# EAGLE design ECEN 4350 Lab 3 (EAGLE 9.6.2)

## Sheet 1 of 8
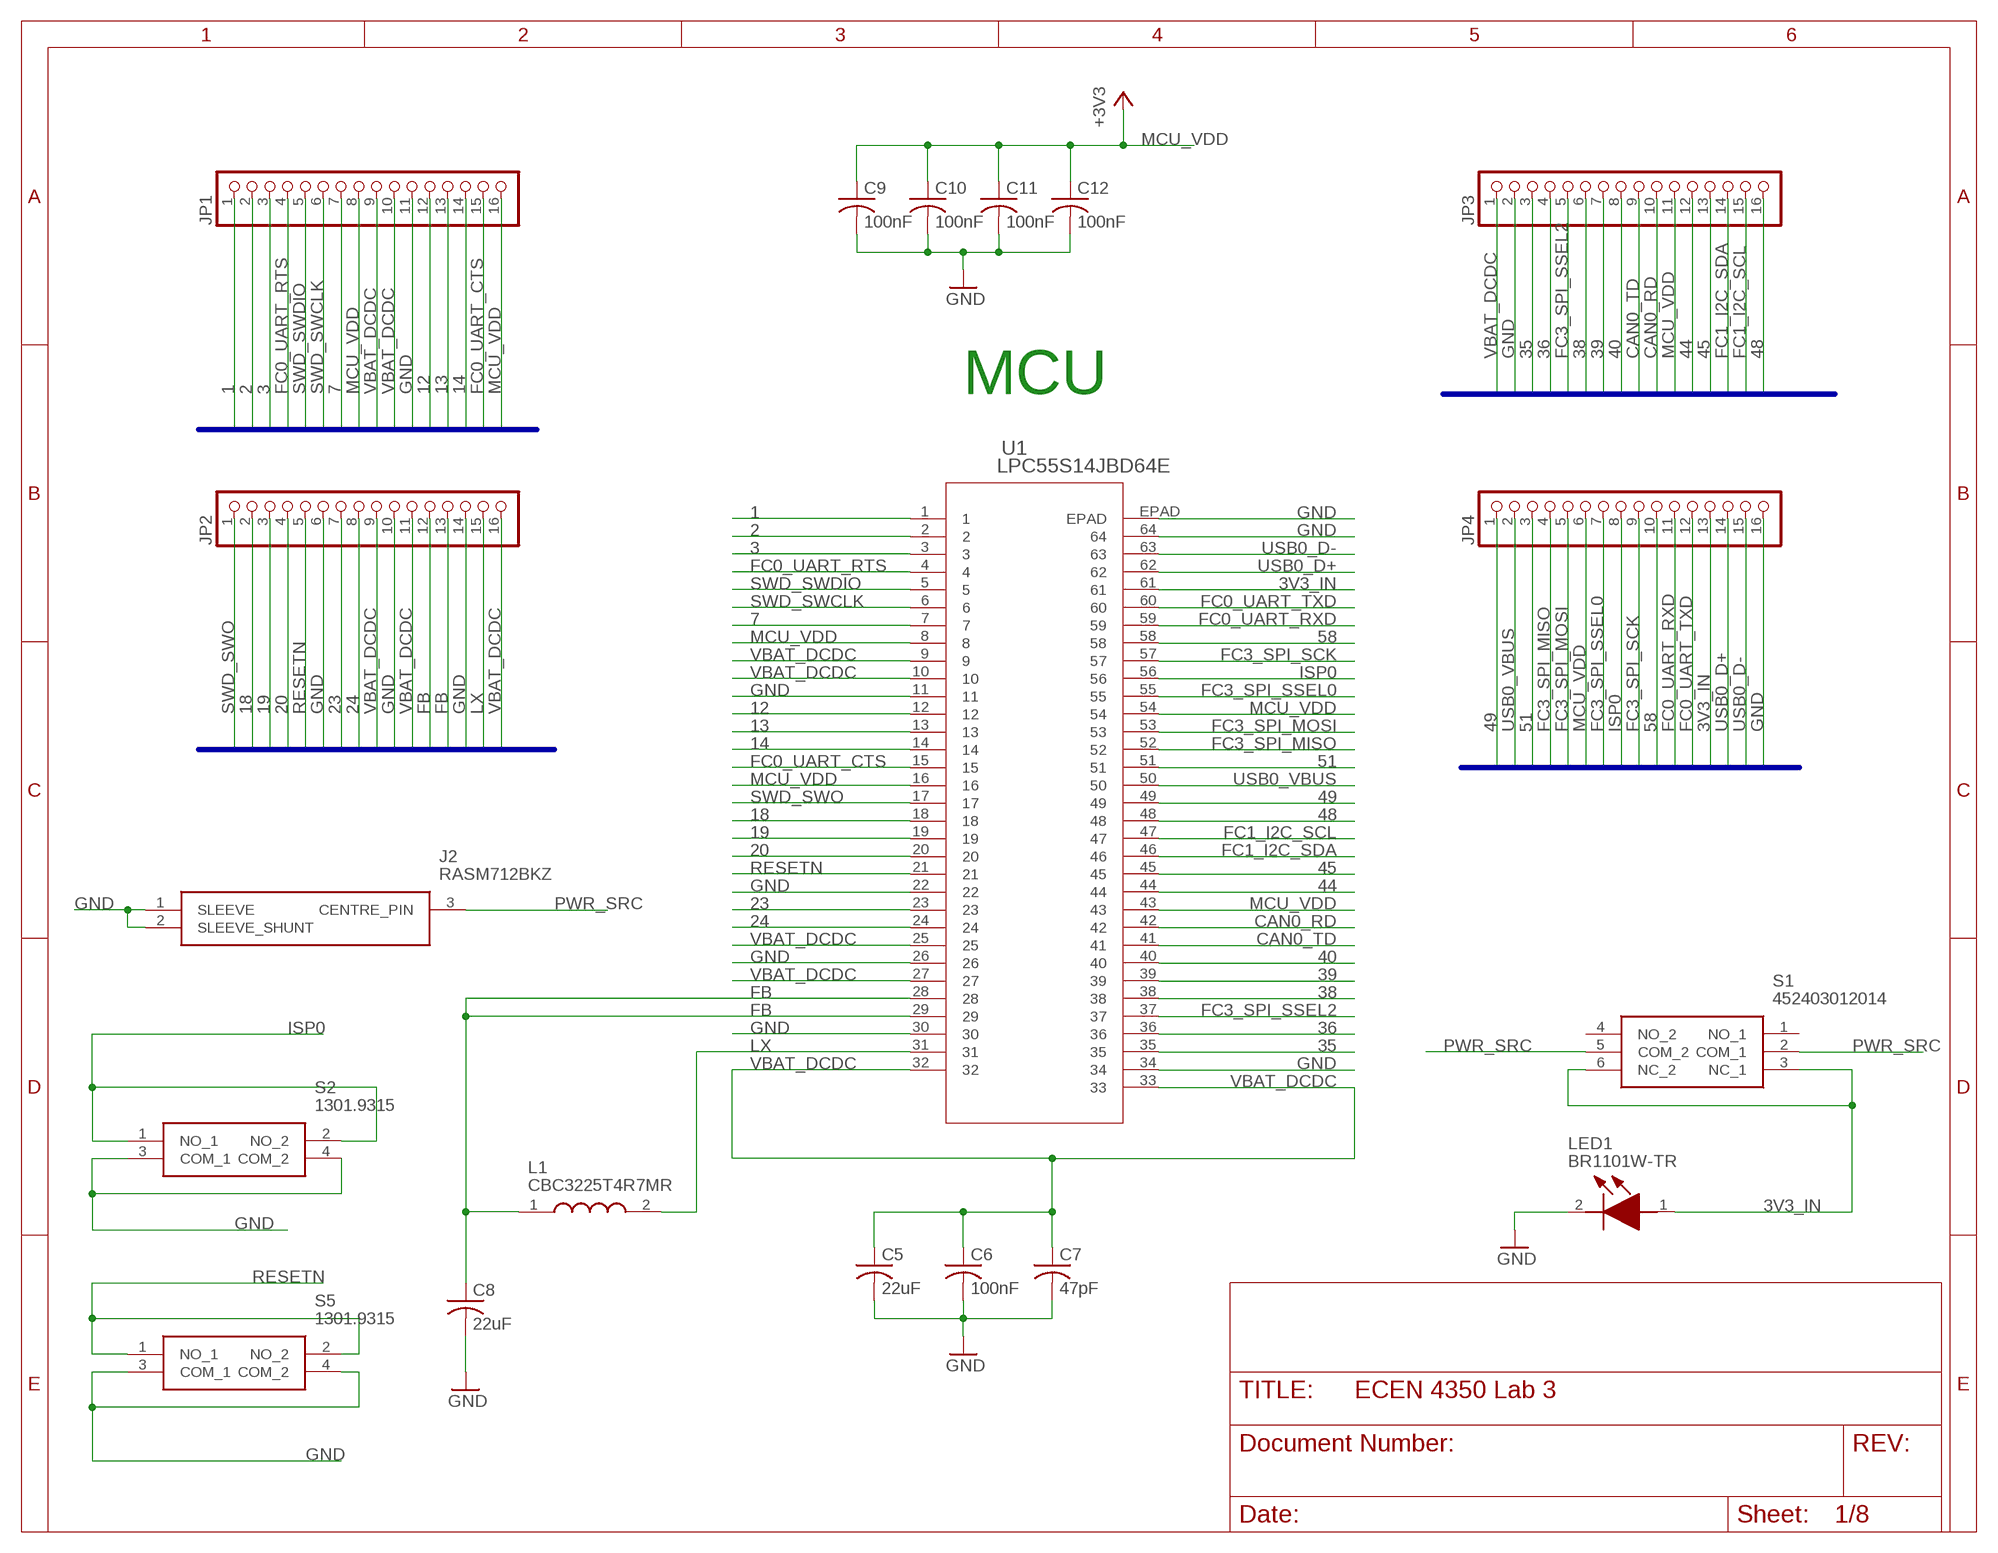
[diagram p0: schematic, sheet 1]

### Parts
C5  22uF  C-USC1206  [C1206]
C6  100nF  C-USC1206  [C1206]
C7  47pF  C-USC1206  [C1206]
C8  22uF  C-USC1206  [C1206]
C9  100nF  C-USC1206  [C1206]
C10  100nF  C-USC1206  [C1206]
C11  100nF  C-USC1206  [C1206]
C12  100nF  C-USC1206  [C1206]
J2  RASM712BKZ  [RASM712BKZ]
JP1  PINHD-1X16  [1X16]
JP2  PINHD-1X16  [1X16]
JP3  PINHD-1X16  [1X16]
JP4  PINHD-1X16  [1X16]
L1  CBC3225T4R7MR  [INDC3225X270N]
LED1  BR1101W-TR  [BR1101WTR]
S1  452403012014  [452403012014]
S2  1301.9315  [13019319]
S5  1301.9315  [13019319]
U1  LPC55S14JBD64E  [HTQFP64_10X10_NXP]

### Nets
1: JP1.1 U1.1
2: JP1.2 U1.2
3: JP1.3 U1.3
3V3_IN: JP4.13 LED1.1(A) S1.3(NC_1) S1.6(NC_2) U1.61 ; also sheet 3,4,5,6,7,8
7: JP1.7 U1.7
12: JP1.12 U1.12
13: JP1.13 U1.13
14: JP1.14 U1.14
18: JP2.2 U1.18
19: JP2.3 U1.19
20: JP2.4 U1.20
23: JP2.7 U1.23
24: JP2.8 U1.24
35: JP3.3 U1.35
36: JP3.4 U1.36
38: JP3.6 U1.38
39: JP3.7 U1.39
40: JP3.8 U1.40
44: JP3.12 U1.44
45: JP3.13 U1.45
48: JP3.16 U1.48
49: JP4.1 U1.49
51: JP4.3 U1.51
58: JP4.10 U1.58
CAN0_RD: JP3.10 U1.42 ; also sheet 3
CAN0_TD: JP3.9 U1.41 ; also sheet 3
FB: C8.1 JP2.12 JP2.13 L1.1 U1.28 U1.29
FC0_UART_CTS: JP1.15 U1.15
FC0_UART_RTS: JP1.4 U1.4
FC0_UART_RXD: JP4.11 U1.59 ; also sheet 5
FC0_UART_TXD: JP4.12 U1.60 ; also sheet 5
FC1_I2C_SCL: JP3.15 U1.47 ; also sheet 7,8
FC1_I2C_SDA: JP3.14 U1.46 ; also sheet 7,8
FC3_SPI_MISO: JP4.4 U1.52 ; also sheet 4,7
FC3_SPI_MOSI: JP4.5 U1.53 ; also sheet 4,7
FC3_SPI_SCK: JP4.9 U1.57 ; also sheet 4,7
FC3_SPI_SSEL0: JP4.7 U1.55 ; also sheet 4
FC3_SPI_SSEL2: JP3.5 U1.37 ; also sheet 7
GND: C5.2 C6.2 C7.2 C8.2 C9.2 C10.2 C11.2 C12.2 J2.1(SLEEVE) J2.2(SLEEVE_SHUNT) JP1.11 JP2.6 JP2.10 JP2.14 JP3.2 JP4.16 LED1.2(K) S2.3(COM_1) S2.4(COM_2) S5.3(COM_1) S5.4(COM_2) U1.11 U1.22 U1.26 U1.30 U1.34 U1.64 U1.EPAD ; also sheet 2,3,4,5,6,7,8
ISP0: JP4.8 S2.1(NO_1) S2.2(NO_2) U1.56
LX: JP2.15 L1.2 U1.31
MCU_VDD: C9.1 C10.1 C11.1 C12.1 JP1.8 JP1.16 JP3.11 JP4.6 U1.8 U1.16 U1.43 U1.54 ; supply symbol labelled +3V3
PWR_SRC: J2.3(CENTRE_PIN) S1.2(COM_1) S1.5(COM_2)
RESETN: JP2.5 S5.1(NO_1) S5.2(NO_2) U1.21 ; also sheet 6
SWD_SWCLK: JP1.6 U1.6 ; also sheet 6
SWD_SWDIO: JP1.5 U1.5 ; also sheet 6
SWD_SWO: JP2.1 U1.17 ; also sheet 6
USB0_D+: JP4.14 U1.62 ; also sheet 2
USB0_D-: JP4.15 U1.63 ; also sheet 2
USB0_VBUS: JP4.2 U1.50 ; also sheet 2
VBAT_DCDC: C5.1 C6.1 C7.1 JP1.9 JP1.10 JP2.9 JP2.11 JP2.16 JP3.1 U1.9 U1.10 U1.25 U1.27 U1.32 U1.33
Unconnected: S1.1(NO_1) S1.4(NO_2)

### Buses
MCU1:1,2,3,7,8,9,10,11,12,13,14,16,FC0_UART_CTS,FC0_UART_RTS,SWD_SWCLK,SWD_SWDIO
MCU2:18,19,20,FB,LX,RESETN,SWD_SWO,USB1_DP,USB1_VSS,VBAT_DCDC,VSS_DCDC
34,35,36,38,39,40,43,44,45,48,CAN0_RD,CAN0_TD,FC1_I2C_SCL,FC1_I2C_SDA,FC3_SPI_SSEL2,GND,VBAT_PMU
49,51,58,FC0_UART_RXD,FC0_UART_TXD,FC3_SPI_MISO,FC3_SPI_MOSI,FC3_SPI_SCK,FC3_SPI_SSEL0,ISP0,USB0_3V3,USB0_D-,USB0_D+,USB0_VBUS,USB0_VSS,VDD

### Notes on the sheet
- MCU

## Sheet 2 of 8
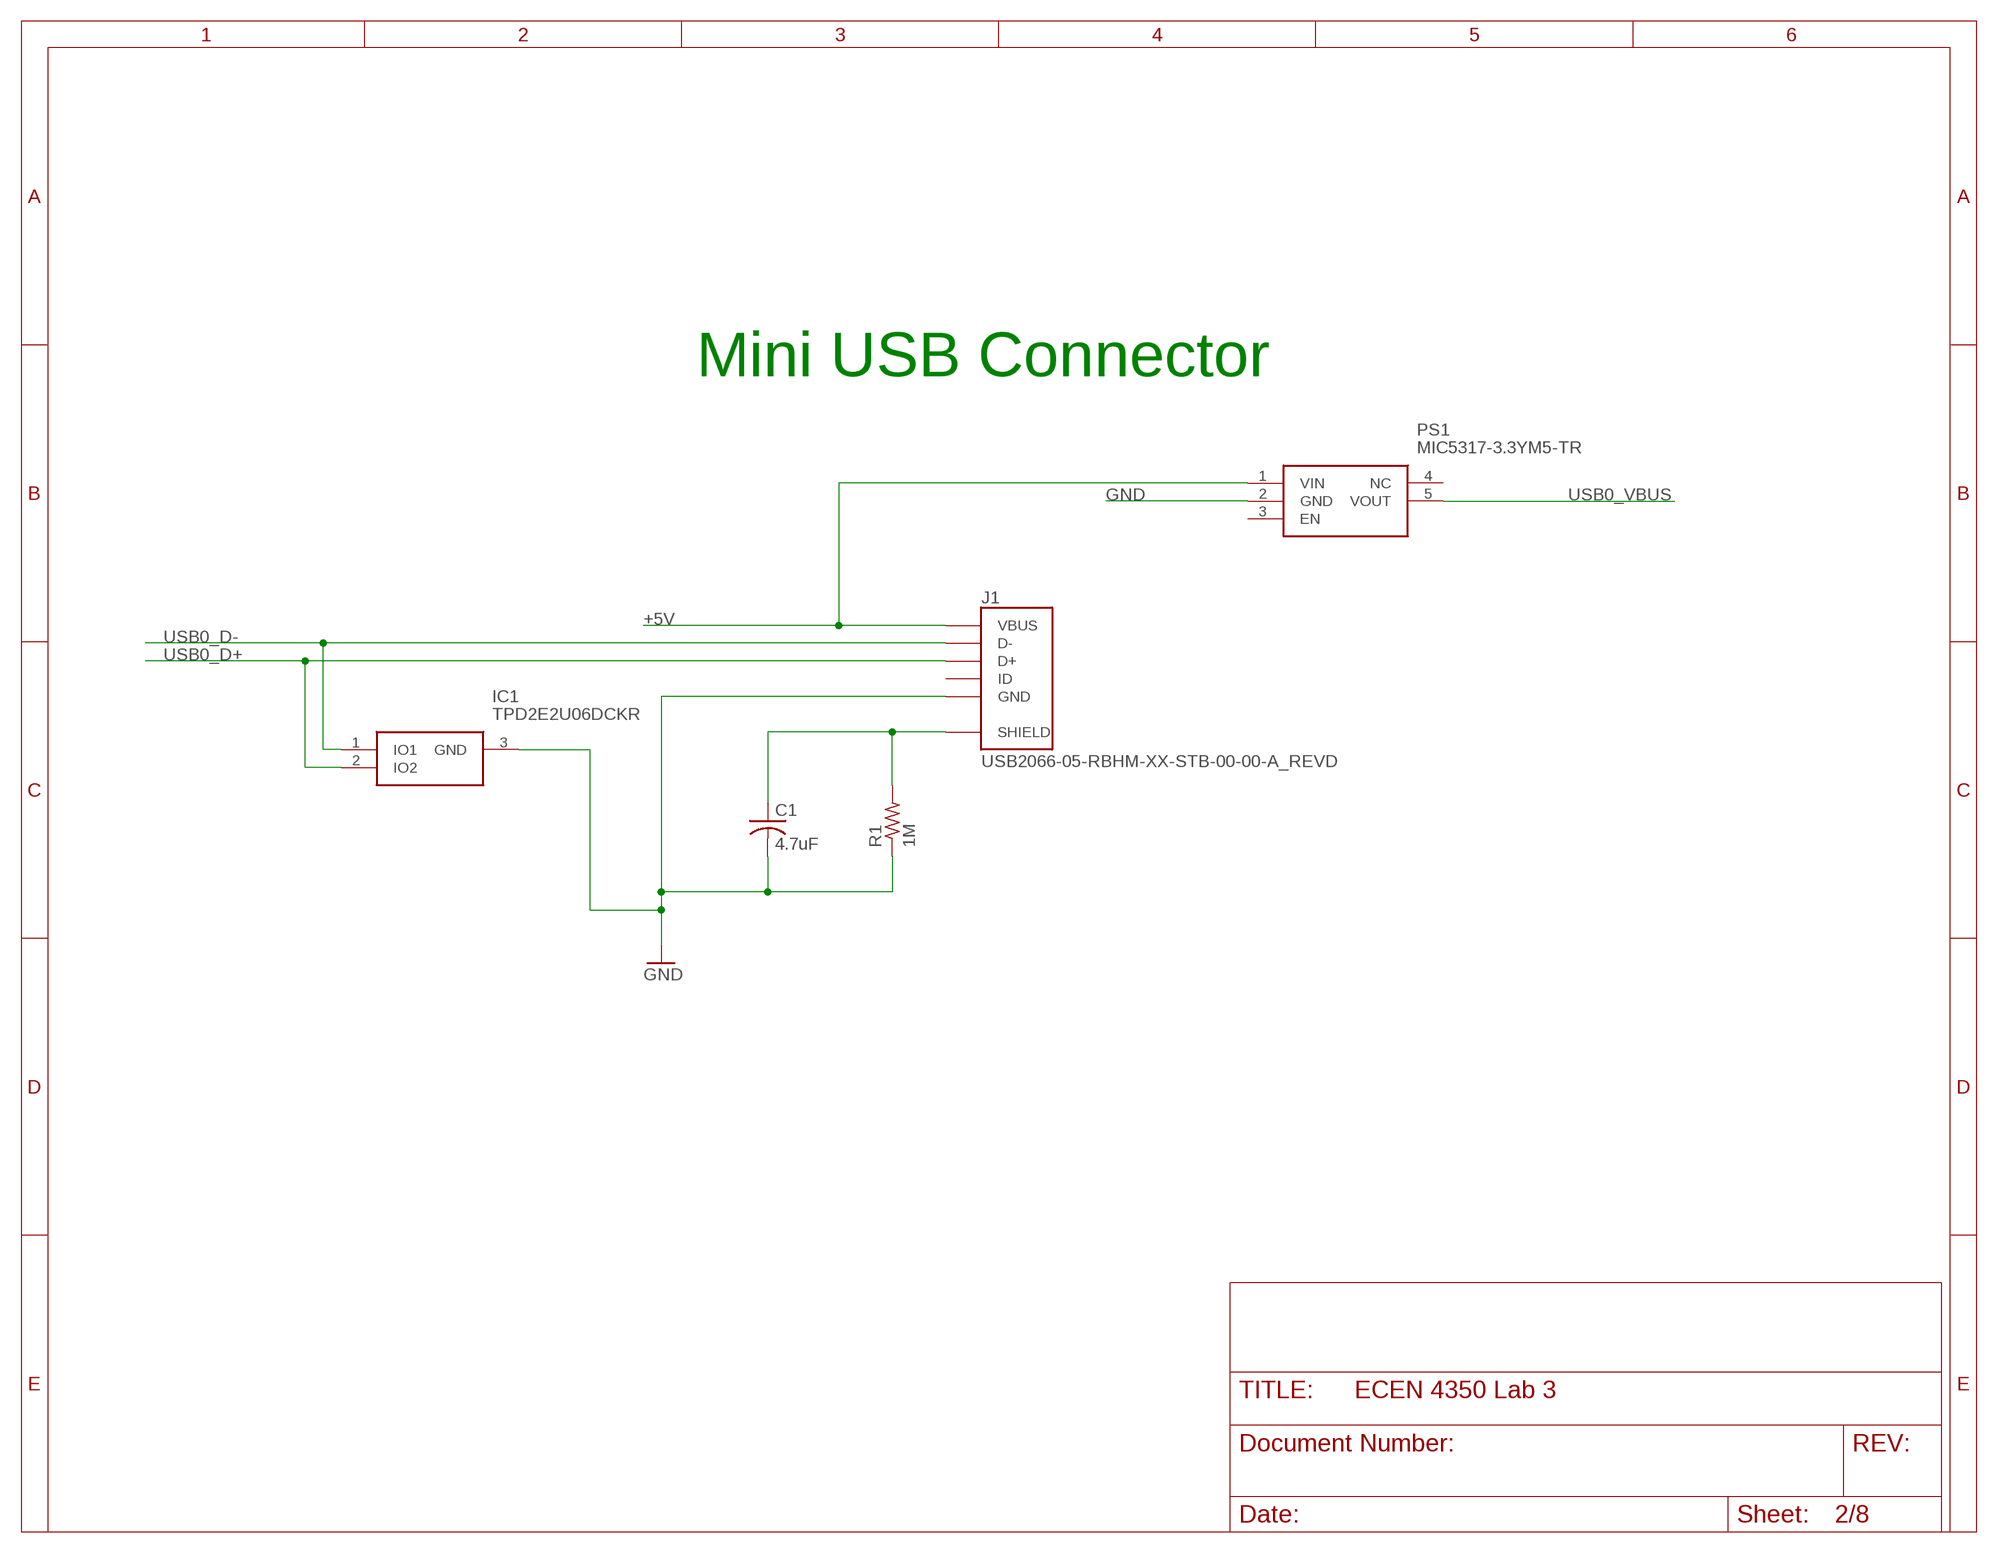
[diagram p1: schematic, sheet 2]

### Parts
C1  4.7uF  C-USC1206  [C1206]
IC1  TPD2E2U06DCKR  [SOT65P210X110-3N]
J1  USB2066-05-RBHM-XX-STB-00-00-A_REVD  [GCT_USB2066-05-RBHM-XX-STB-00-00-A_REVD]
PS1  MIC5317-3.3YM5-TR  [SOT95P280X100-5N]
R1  1M  R-US_R1206  [R1206]

### Nets
+5V: J1.1(VBUS) PS1.1(VIN)
GND: C1.2 IC1.3(GND) J1.5(GND) PS1.2(GND) R1.1 ; also sheet 1,3,4,5,6,7,8
N$7: C1.1 J1.6(SHIELD) J1.7(SHIELD) J1.8(SHIELD) J1.9(SHIELD) R1.2
USB0_D+: IC1.2(IO2) J1.3(D+) ; also sheet 1
USB0_D-: IC1.1(IO1) J1.2(D-) ; also sheet 1
USB0_VBUS: PS1.5(VOUT) ; also sheet 1
Unconnected: J1.4(ID) PS1.3(EN) PS1.4(NC)

### Notes on the sheet
- Mini USB Connector

## Sheet 3 of 8
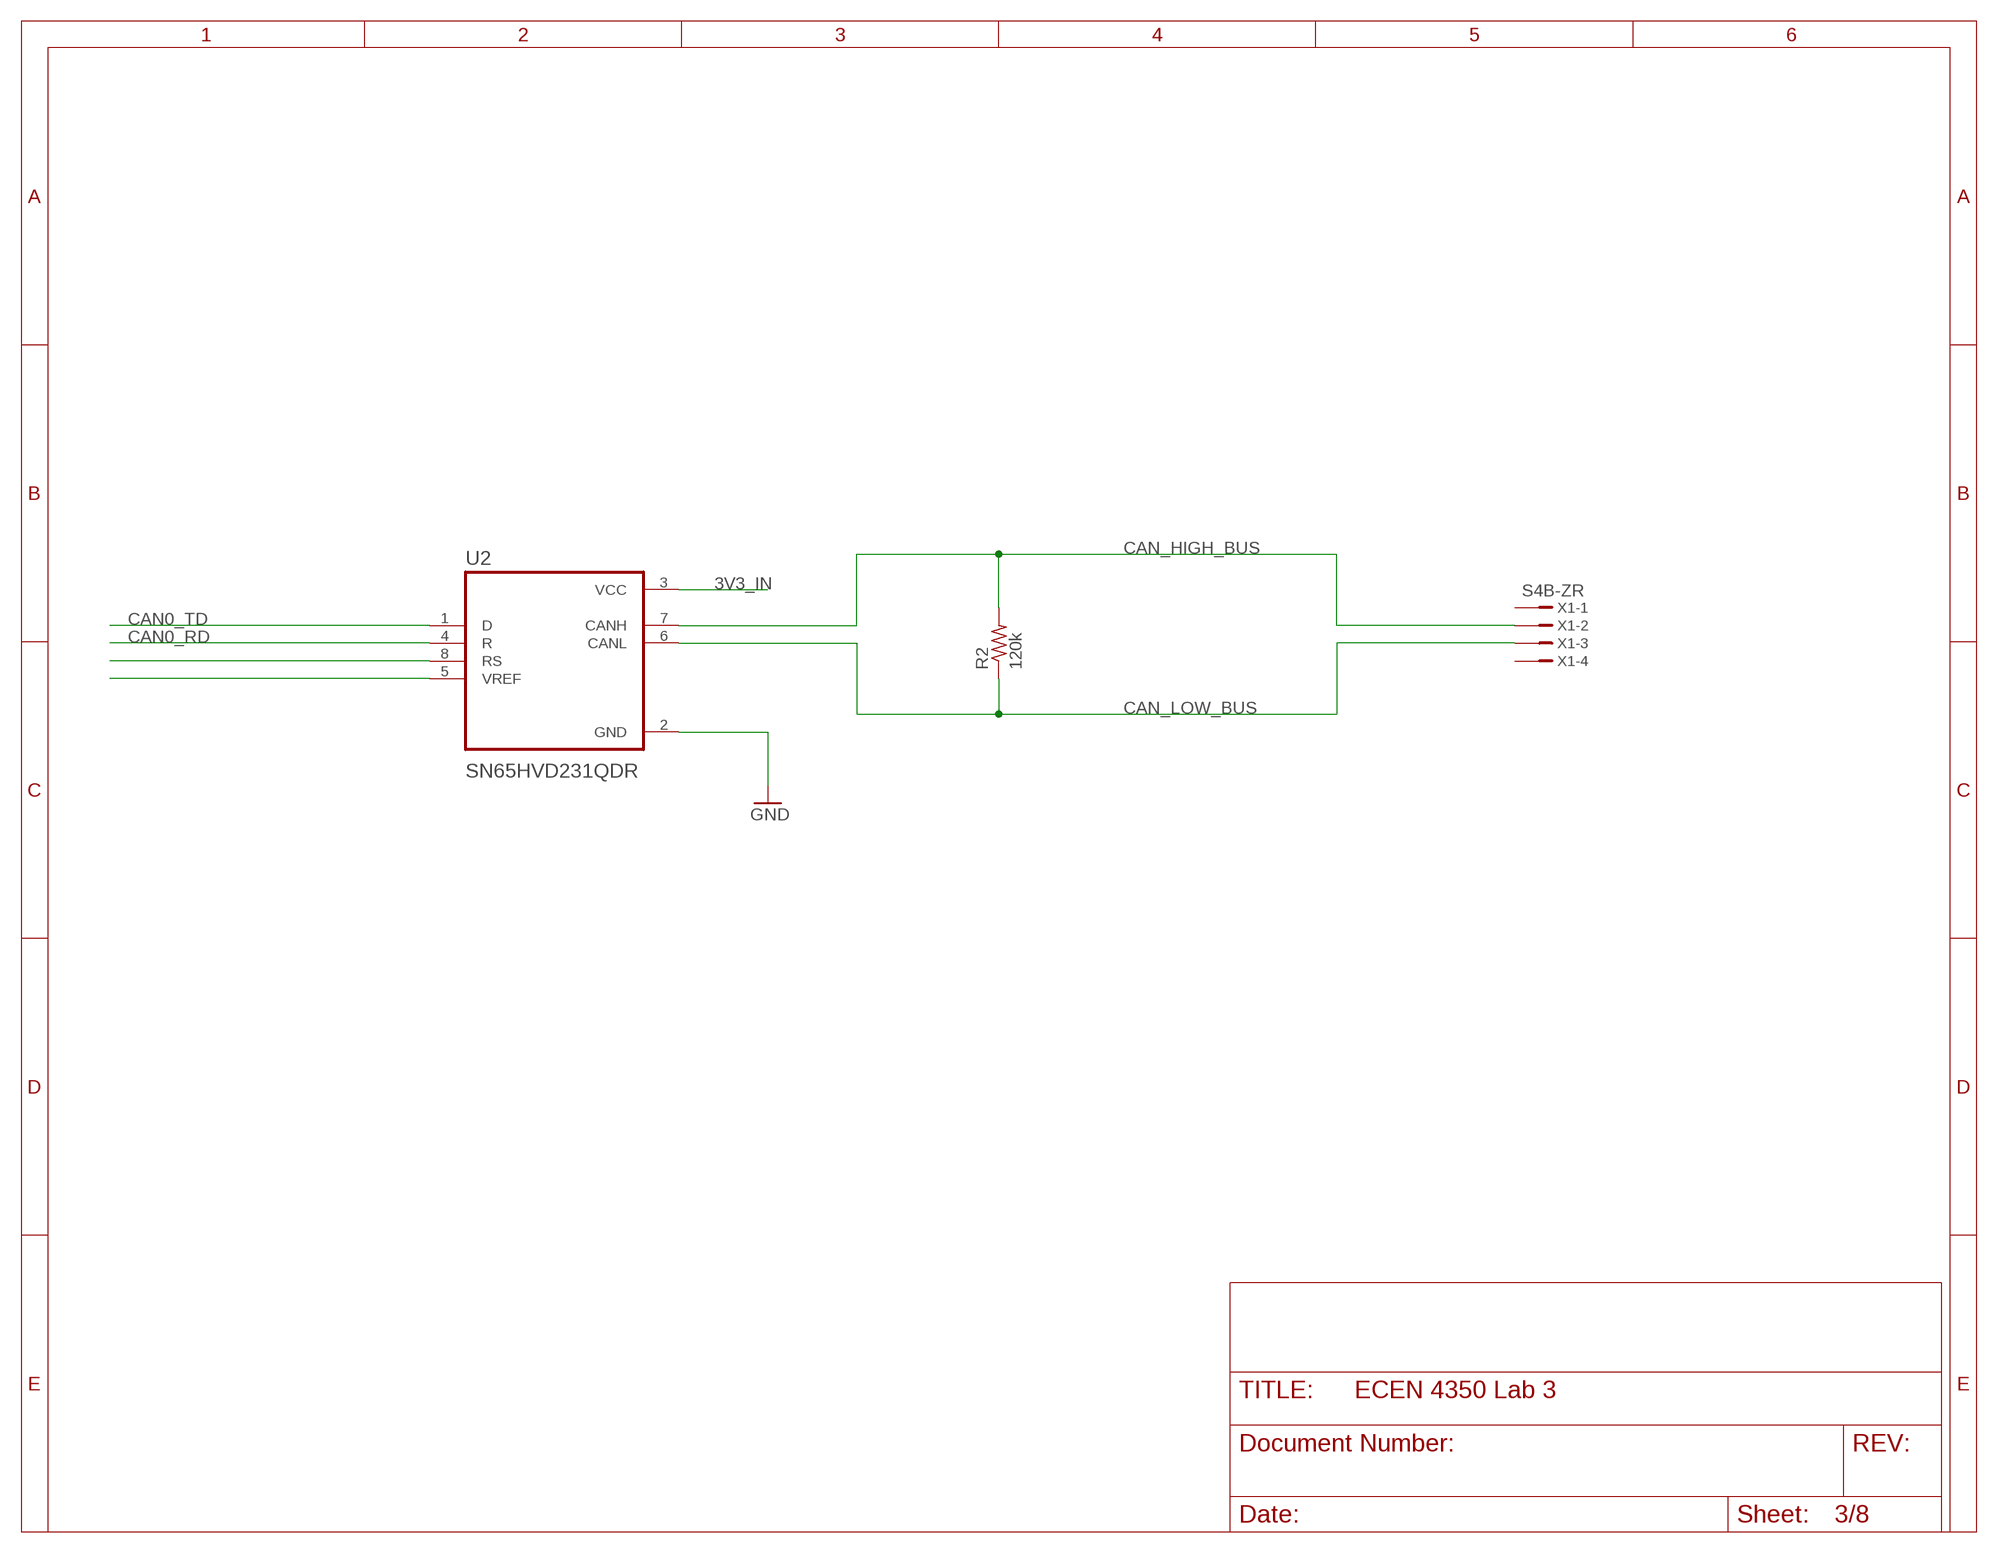
[diagram p2: schematic, sheet 3]

### Parts
R2  120k  R-US_R1206  [R1206]
U2  SN65HVD231QDR  [SOIC127P599X175-8N]
X1  S4B-ZR  [S4B-ZR]

### Nets
3V3_IN: U2.3(VCC) ; also sheet 1,4,5,6,7,8
CAN0_RD: U2.4(R) ; also sheet 1
CAN0_TD: U2.1(D) ; also sheet 1
CAN_HIGH_BUS: R2.2 U2.7(CANH) X1.2
CAN_LOW_BUS: R2.1 U2.6(CANL) X1.3
GND: U2.2(GND) ; also sheet 1,2,4,5,6,7,8
N$5: U2.8(RS)
N$6: U2.5(VREF)
Unconnected: X1.1 X1.4

## Sheet 4 of 8
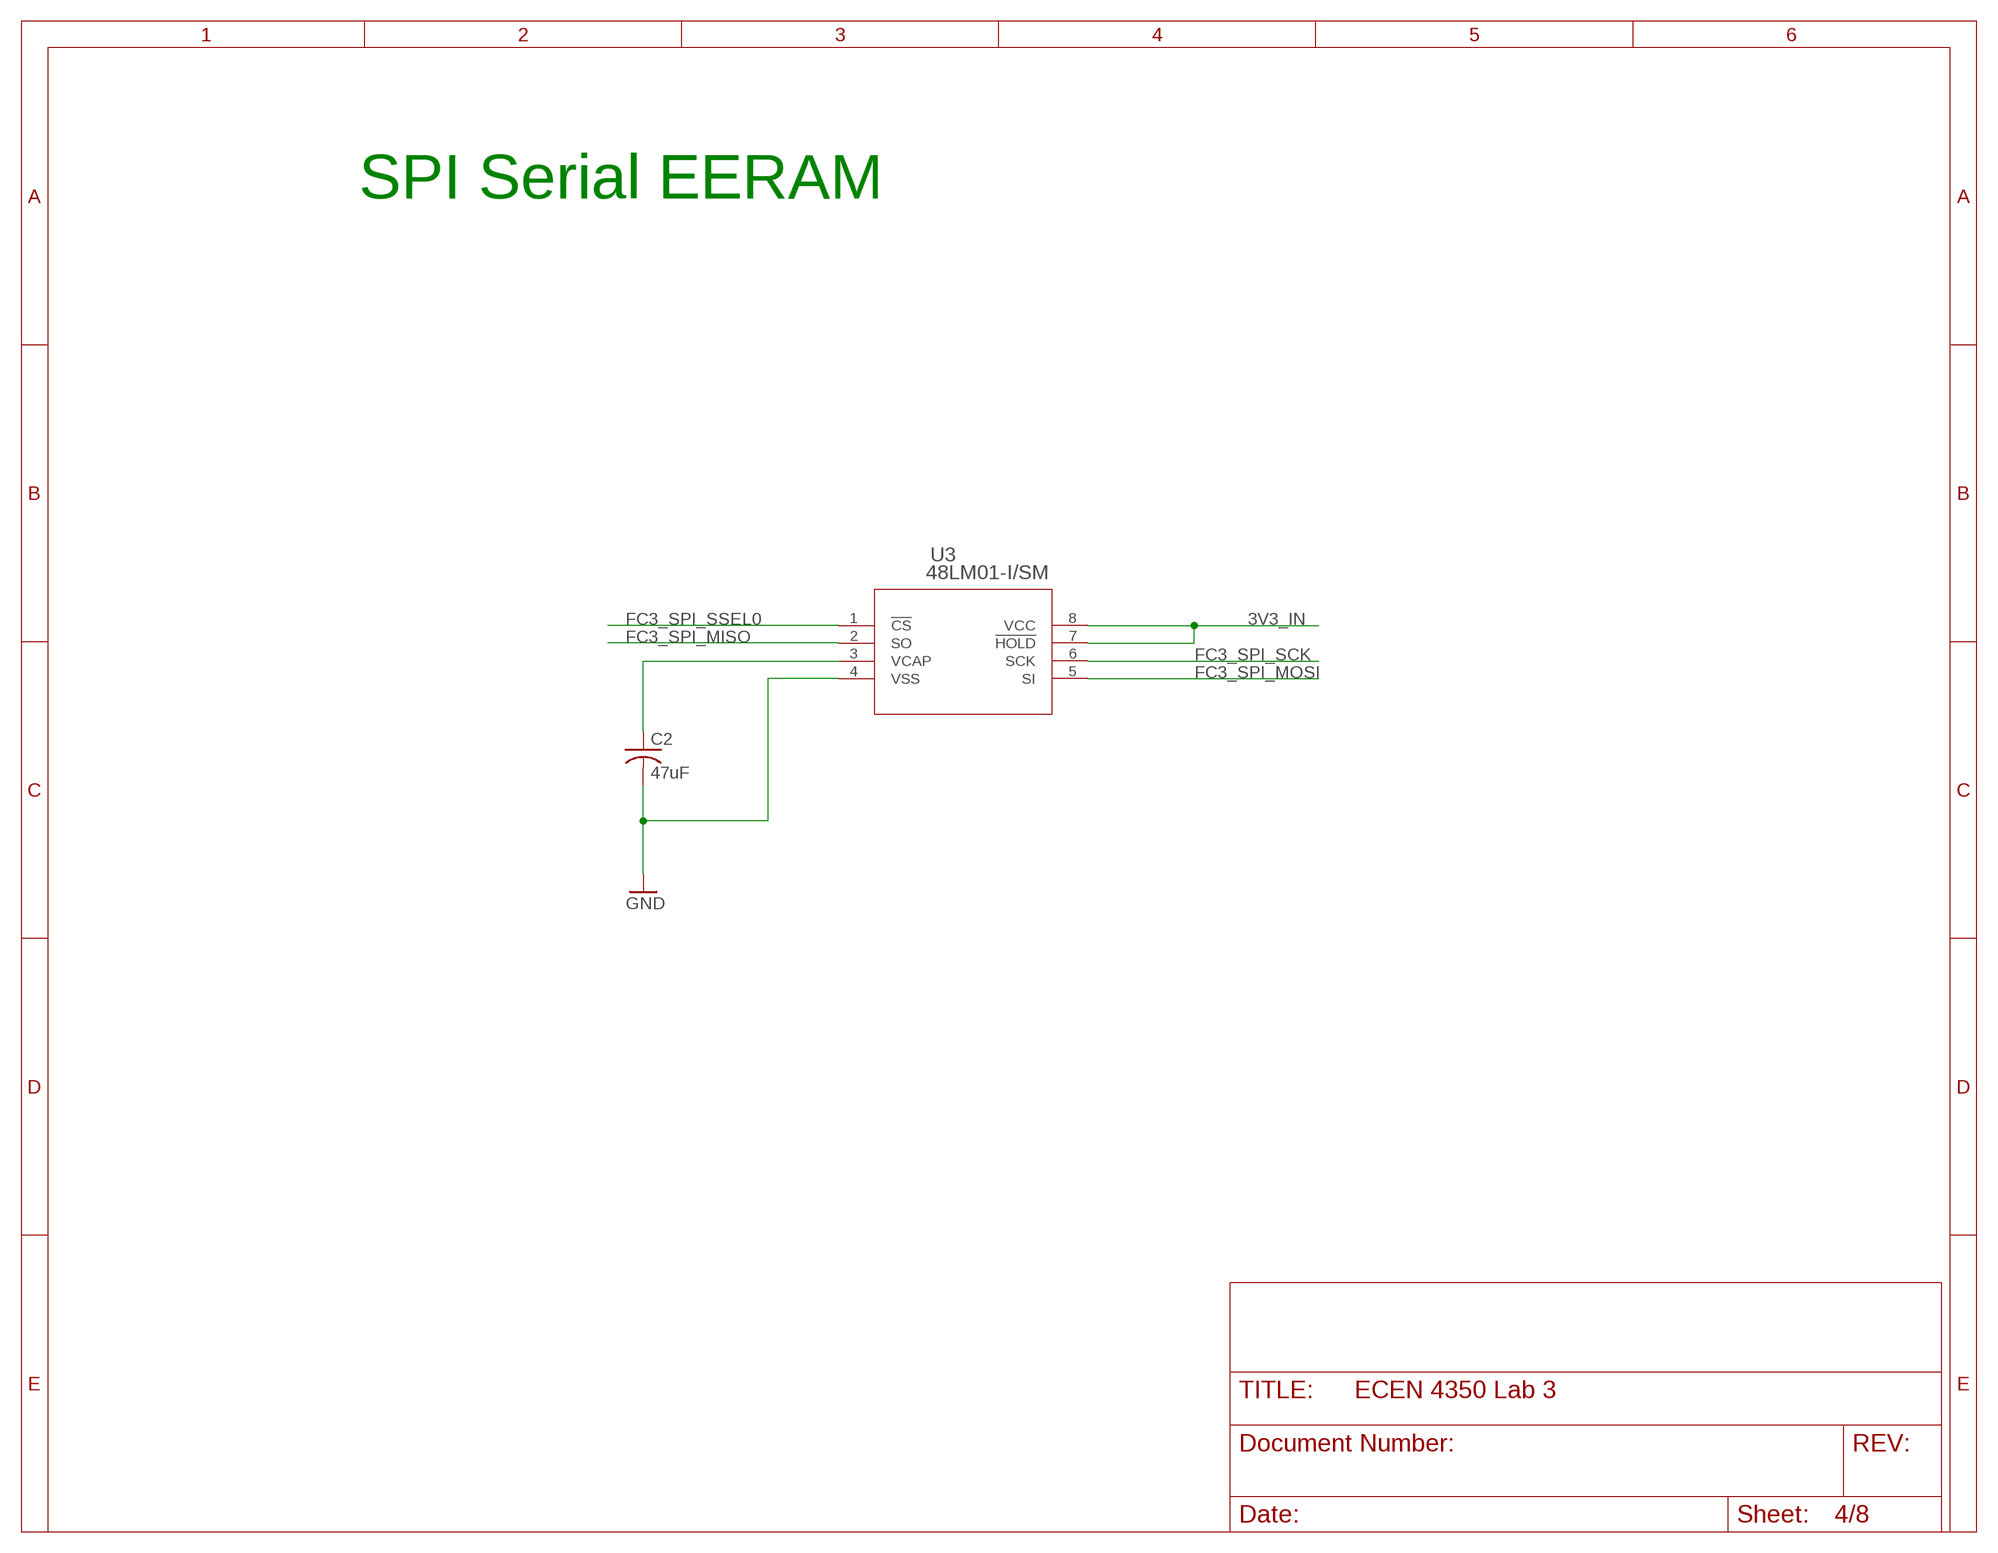
[diagram p3: schematic, sheet 4]

### Parts
C2  47uF  C-USC1206  [C1206]
U3  48LM01-I/SM  [SOIJ8_SM_MCH]

### Nets
3V3_IN: U3.7(!HOLD) U3.8(VCC) ; also sheet 1,3,5,6,7,8
FC3_SPI_MISO: U3.2(SO) ; also sheet 1,7
FC3_SPI_MOSI: U3.5(SI) ; also sheet 1,7
FC3_SPI_SCK: U3.6(SCK) ; also sheet 1,7
FC3_SPI_SSEL0: U3.1(!CS) ; also sheet 1
GND: C2.2 U3.4(VSS) ; also sheet 1,2,3,5,6,7,8
N$3: C2.1 U3.3(VCAP)

### Notes on the sheet
- SPI Serial EERAM

## Sheet 5 of 8
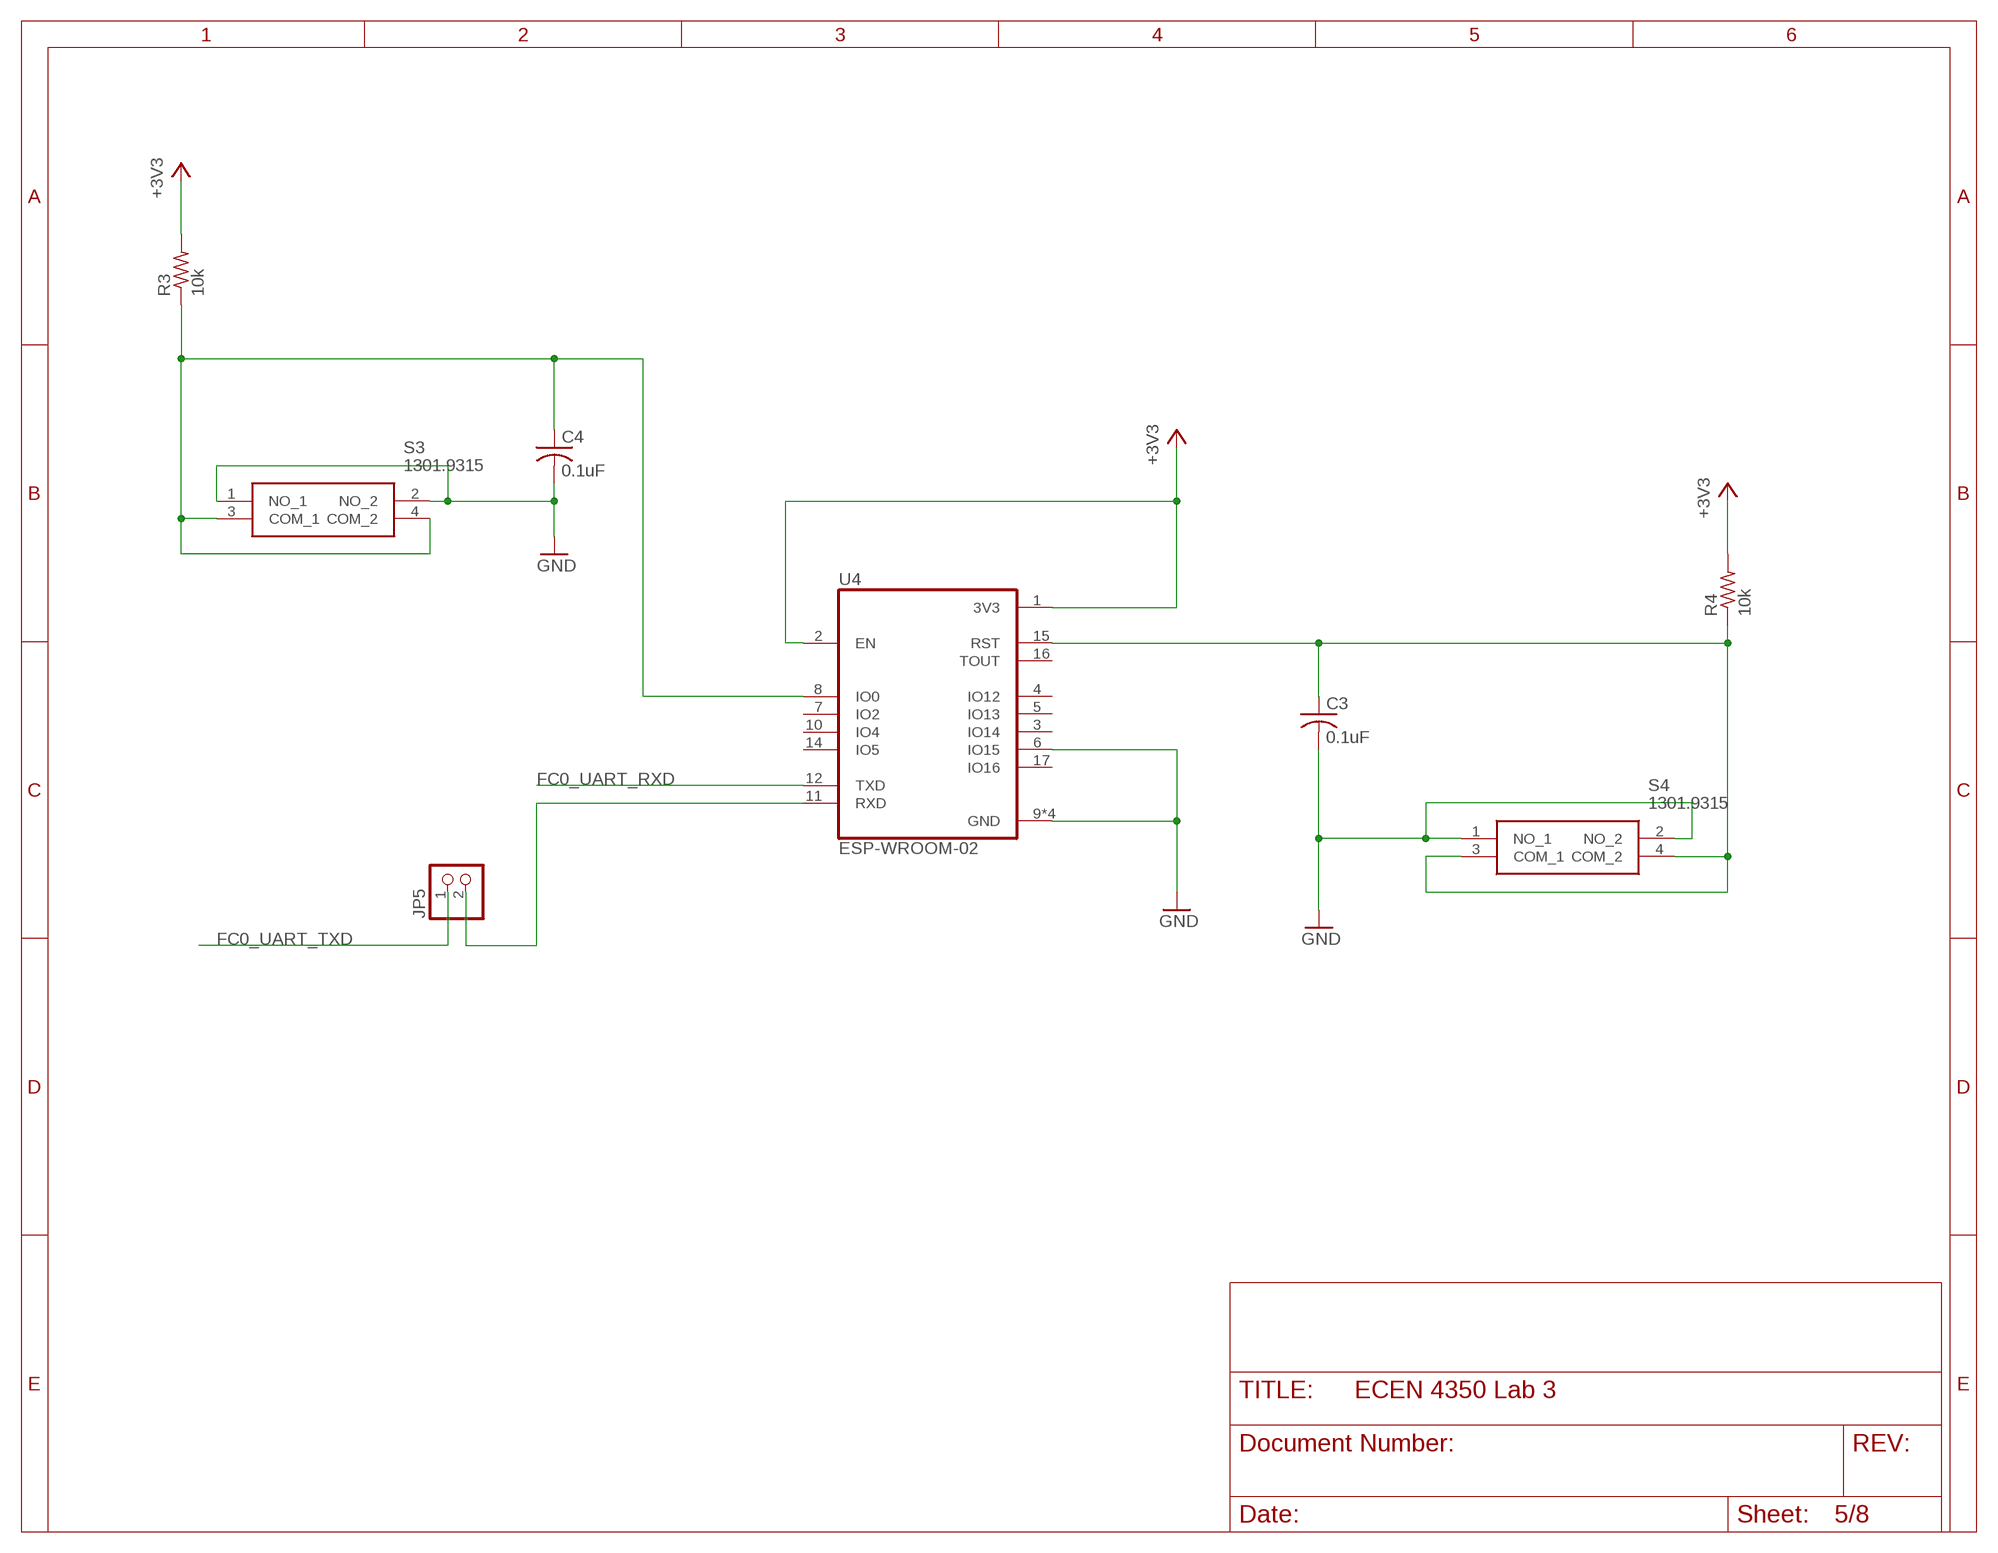
[diagram p4: schematic, sheet 5]

### Parts
C3  0.1uF  C-USC1206  [C1206]
C4  0.1uF  C-USC1206  [C1206]
JP5  PINHD-1X2  [1X02]
R3  10k  R-US_M1206  [M1206]
R4  10k  R-US_M1206  [M1206]
S3  1301.9315  [13019319]
S4  1301.9315  [13019319]
U4  ESP-WROOM-02  [MODULE_ESP-WROOM-02]

### Nets
3V3_IN: R3.2 R4.2 U4.1(3V3) U4.2(EN) ; supply symbol labelled +3V3 ; also sheet 1,3,4,6,7,8
FC0_UART_RXD: U4.12(TXD) ; also sheet 1
FC0_UART_TXD: JP5.1 ; also sheet 1
GND: C3.2 C4.2 S3.1(NO_1) S3.2(NO_2) S4.1(NO_1) S4.2(NO_2) U4.6(IO15) U4.9(GND) U4.13(GND) U4.18(GND) U4.19(GND) ; also sheet 1,2,3,4,6,7,8
N$1: JP5.2 U4.11(RXD)
N$8: C4.1 R3.1 S3.3(COM_1) S3.4(COM_2) U4.8(IO0)
N$11: C3.1 R4.1 S4.3(COM_1) S4.4(COM_2) U4.15(RST)
Unconnected: U4.3(IO14) U4.4(IO12) U4.5(IO13) U4.7(IO2) U4.10(IO4) U4.14(IO5) U4.16(TOUT) U4.17(IO16)

## Sheet 6 of 8
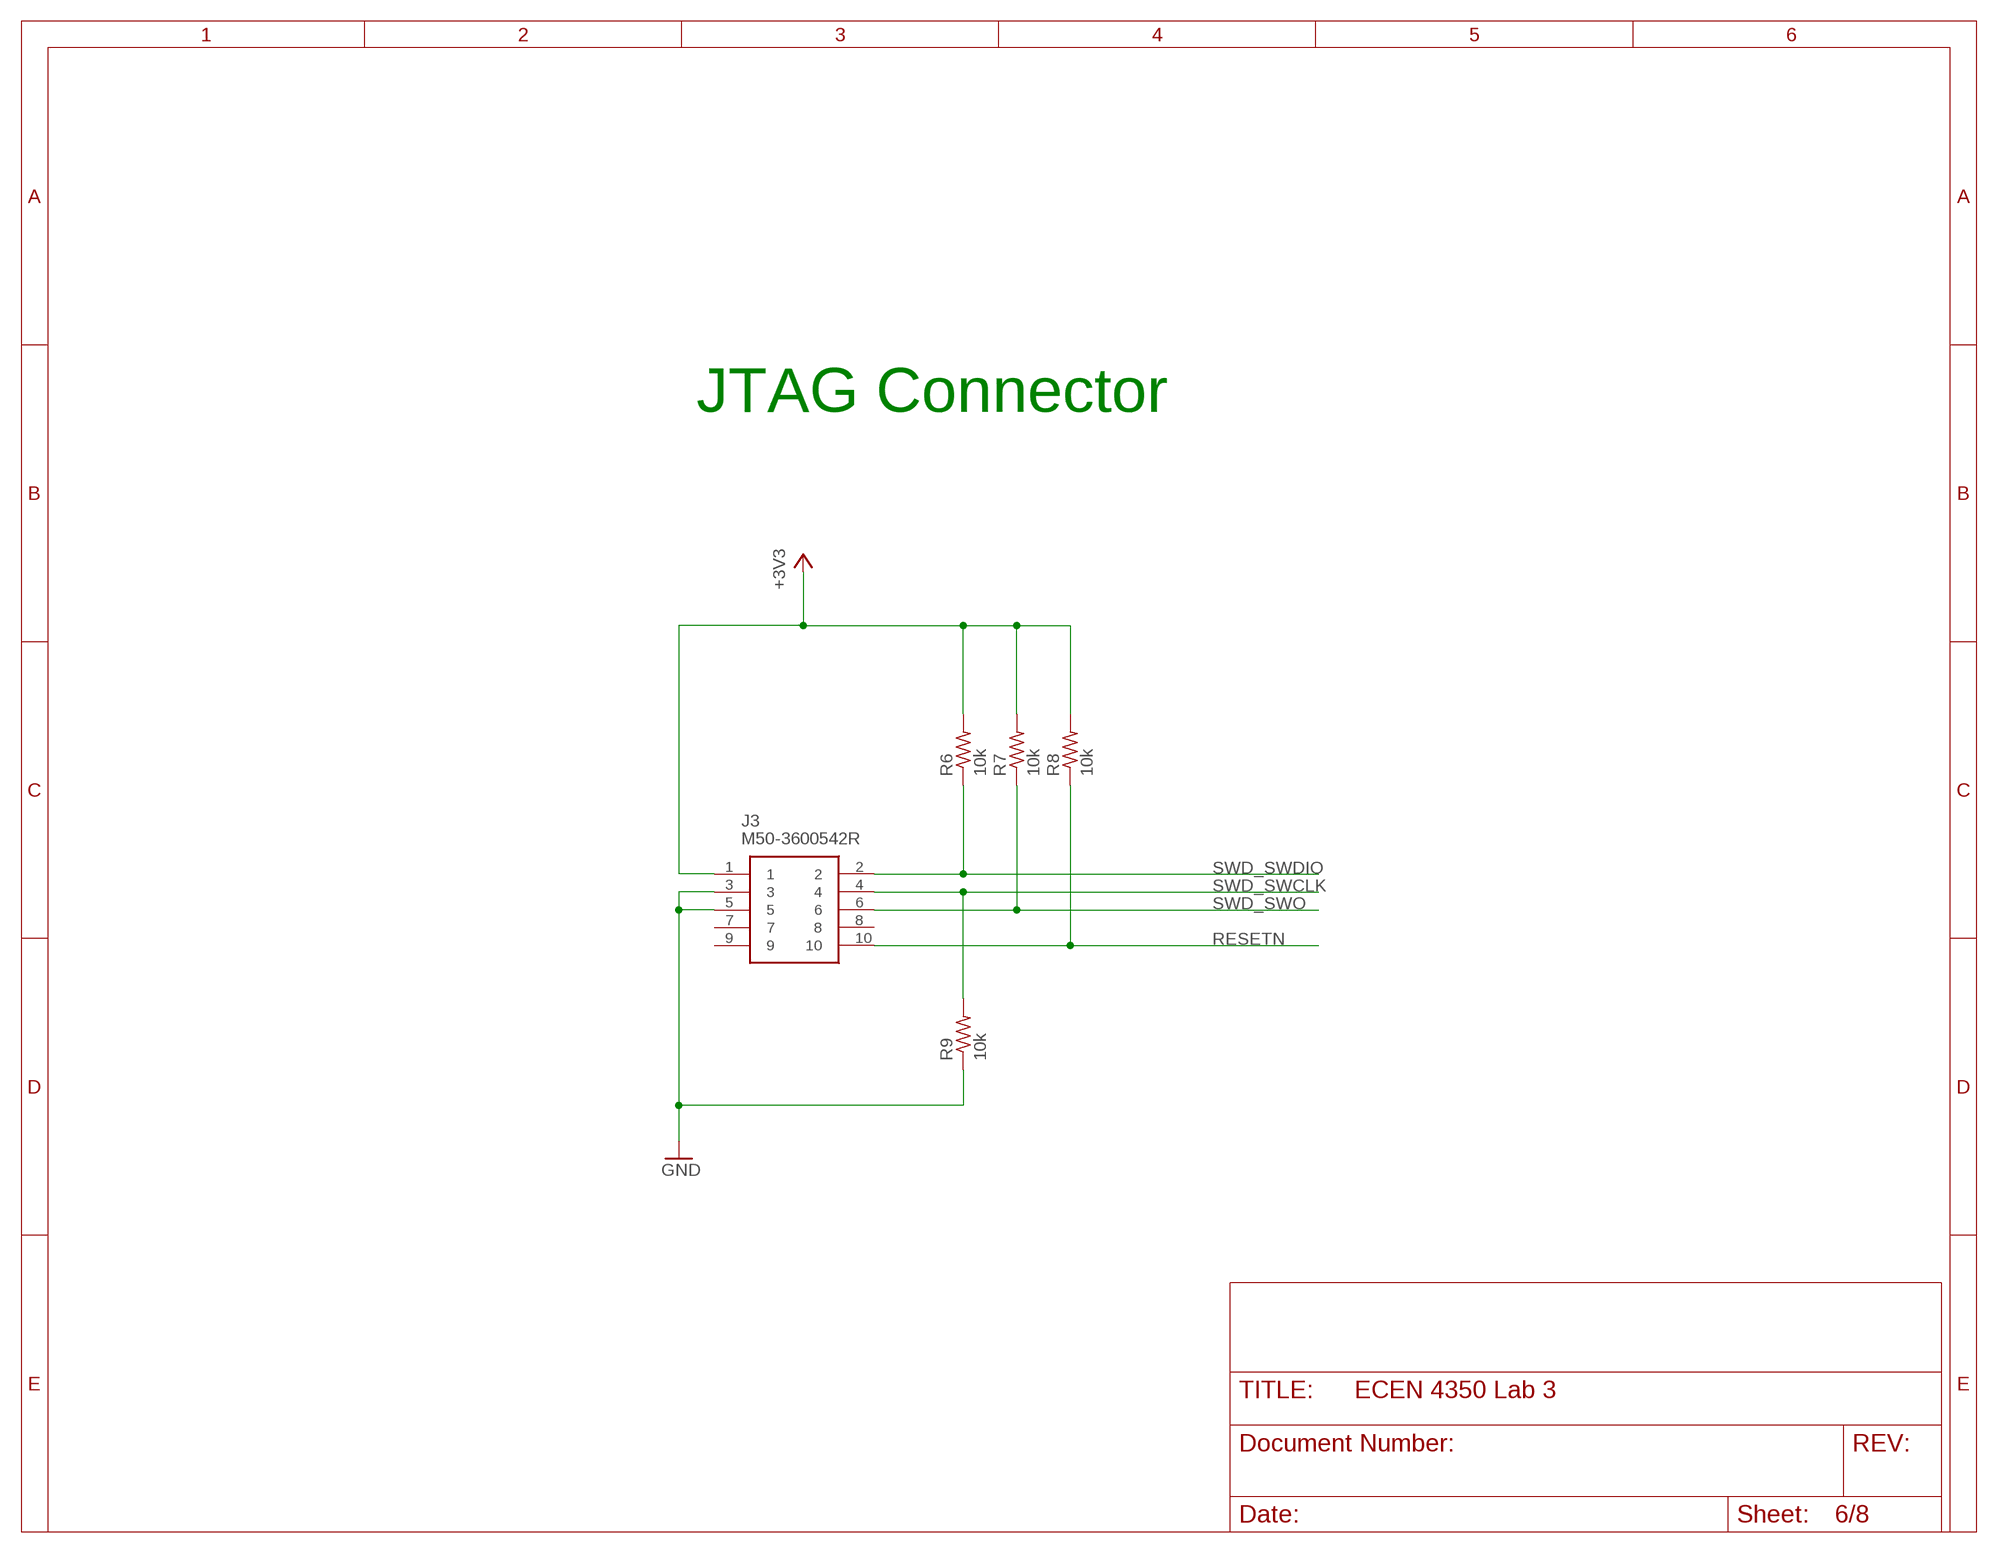
[diagram p5: schematic, sheet 6]

### Parts
J3  M50-3600542R  [HUSSP10W40P127_2X5_635X340X420]
R6  10k  R-US_M1206  [M1206]
R7  10k  R-US_M1206  [M1206]
R8  10k  R-US_M1206  [M1206]
R9  10k  R-US_M1206  [M1206]

### Nets
3V3_IN: J3.1 R6.2 R7.2 R8.2 ; supply symbol labelled +3V3 ; also sheet 1,3,4,5,7,8
GND: J3.3 J3.5 R9.1 ; also sheet 1,2,3,4,5,7,8
RESETN: J3.10 R8.1 ; also sheet 1
SWD_SWCLK: J3.4 R9.2 ; also sheet 1
SWD_SWDIO: J3.2 R6.1 ; also sheet 1
SWD_SWO: J3.6 R7.1 ; also sheet 1
Unconnected: J3.7 J3.8 J3.9

### Notes on the sheet
- JTAG Connector

## Sheet 7 of 8
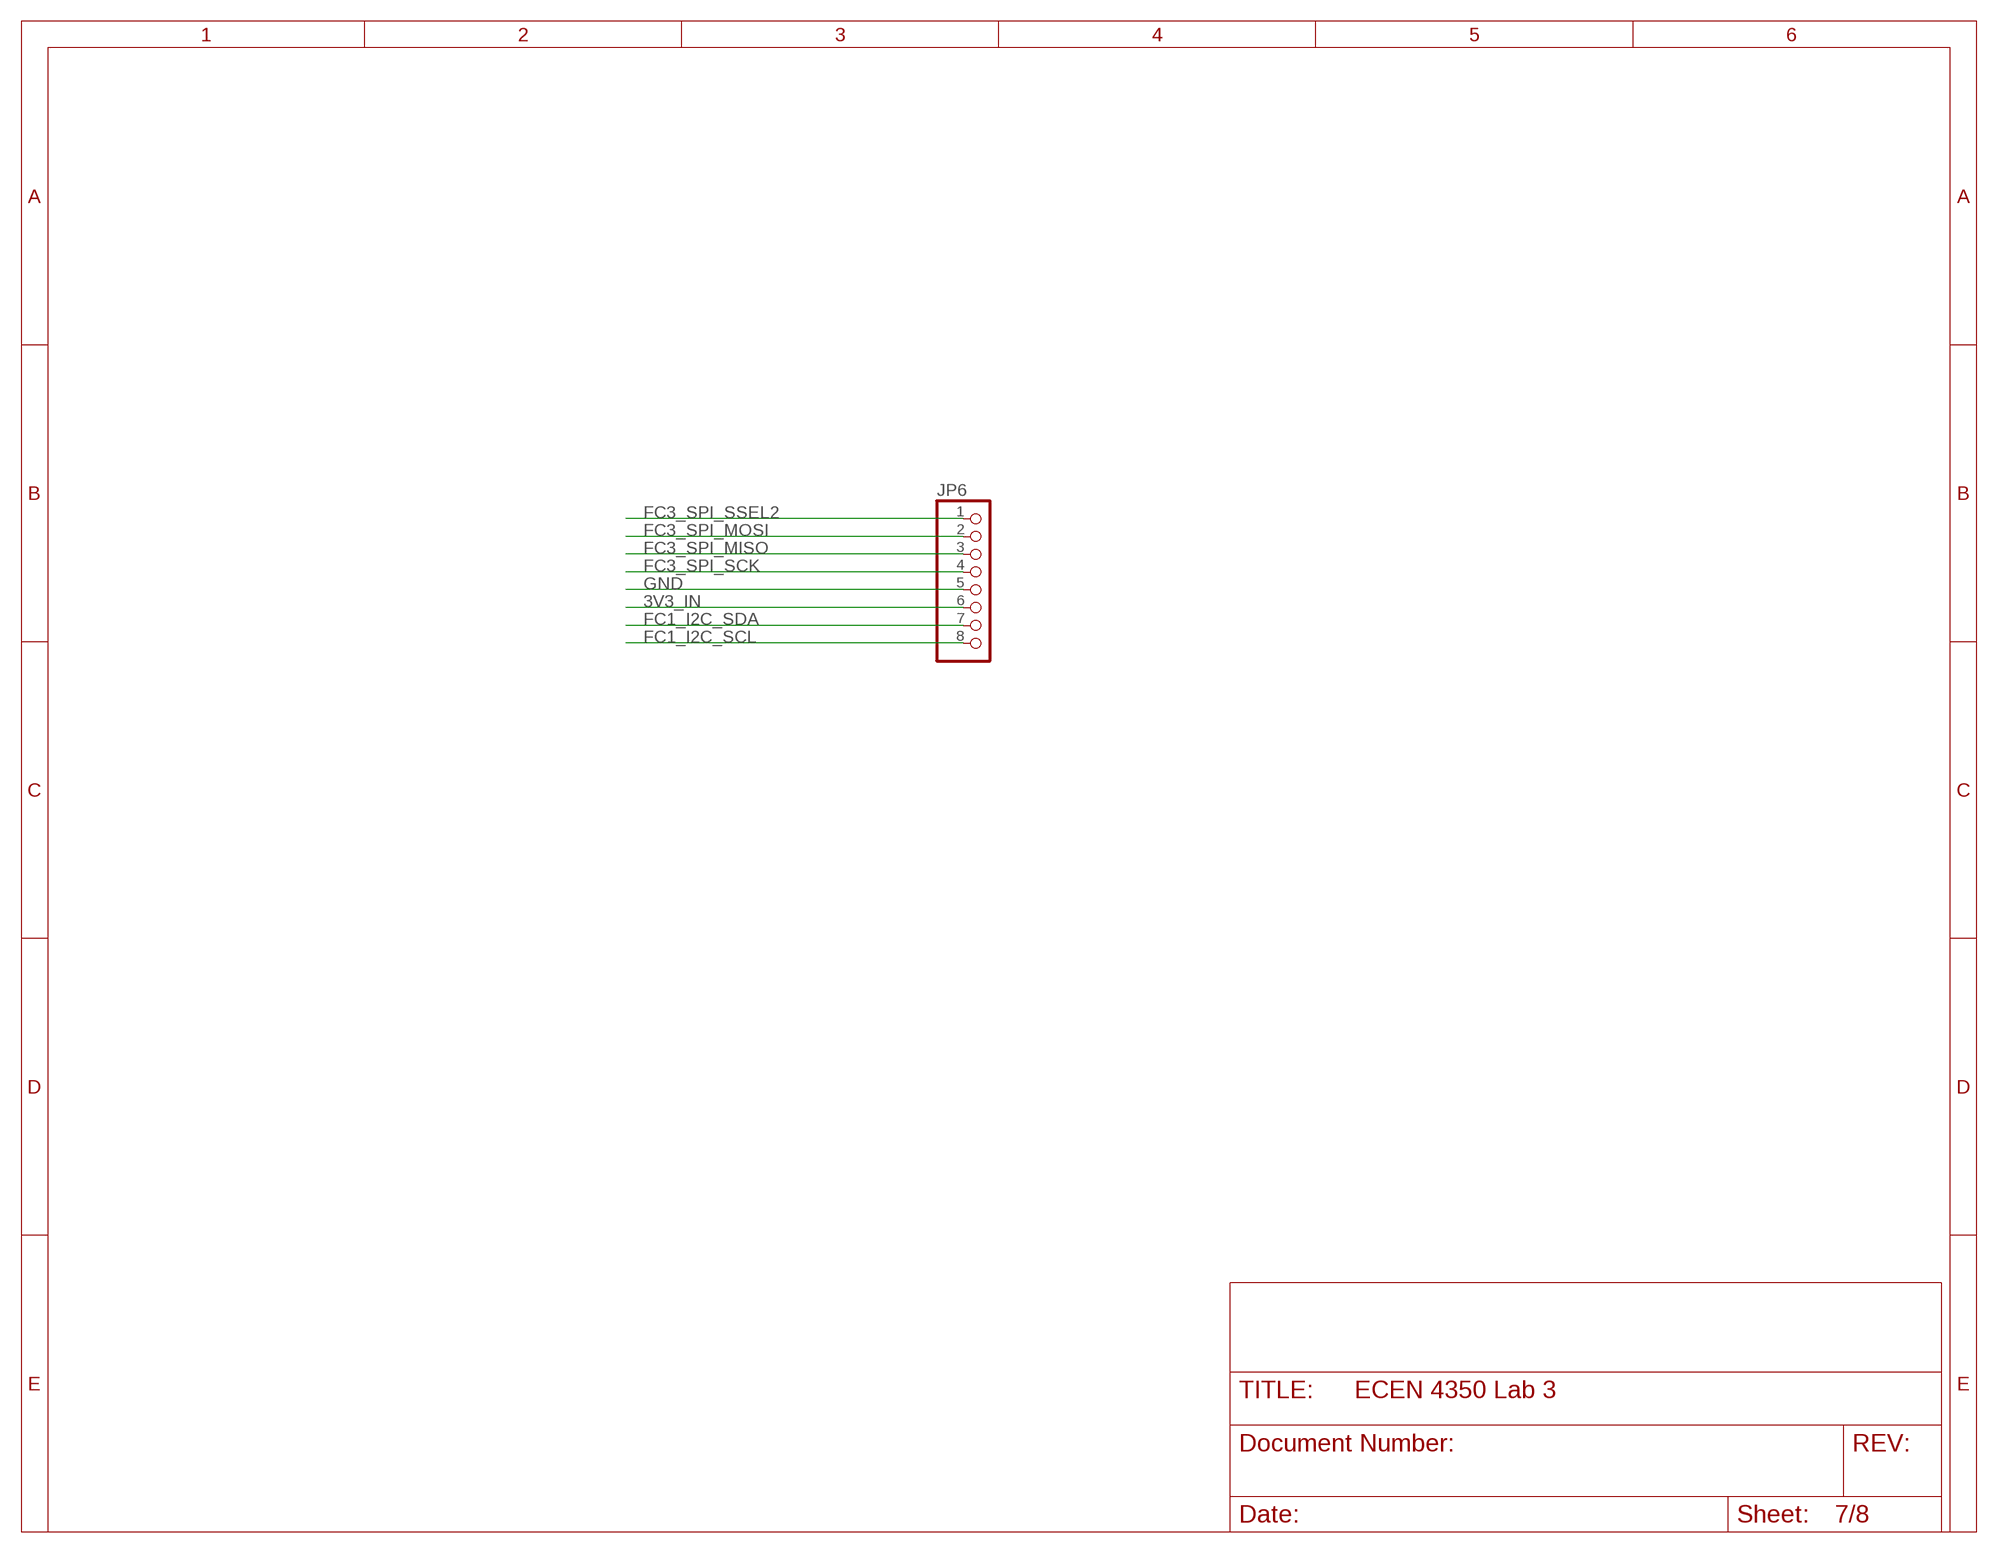
[diagram p6: schematic, sheet 7]

### Parts
JP6  PINHD-1X8  [1X08]

### Nets
3V3_IN: JP6.6 ; also sheet 1,3,4,5,6,8
FC1_I2C_SCL: JP6.8 ; also sheet 1,8
FC1_I2C_SDA: JP6.7 ; also sheet 1,8
FC3_SPI_MISO: JP6.3 ; also sheet 1,4
FC3_SPI_MOSI: JP6.2 ; also sheet 1,4
FC3_SPI_SCK: JP6.4 ; also sheet 1,4
FC3_SPI_SSEL2: JP6.1 ; also sheet 1
GND: JP6.5 ; also sheet 1,2,3,4,5,6,8

## Sheet 8 of 8
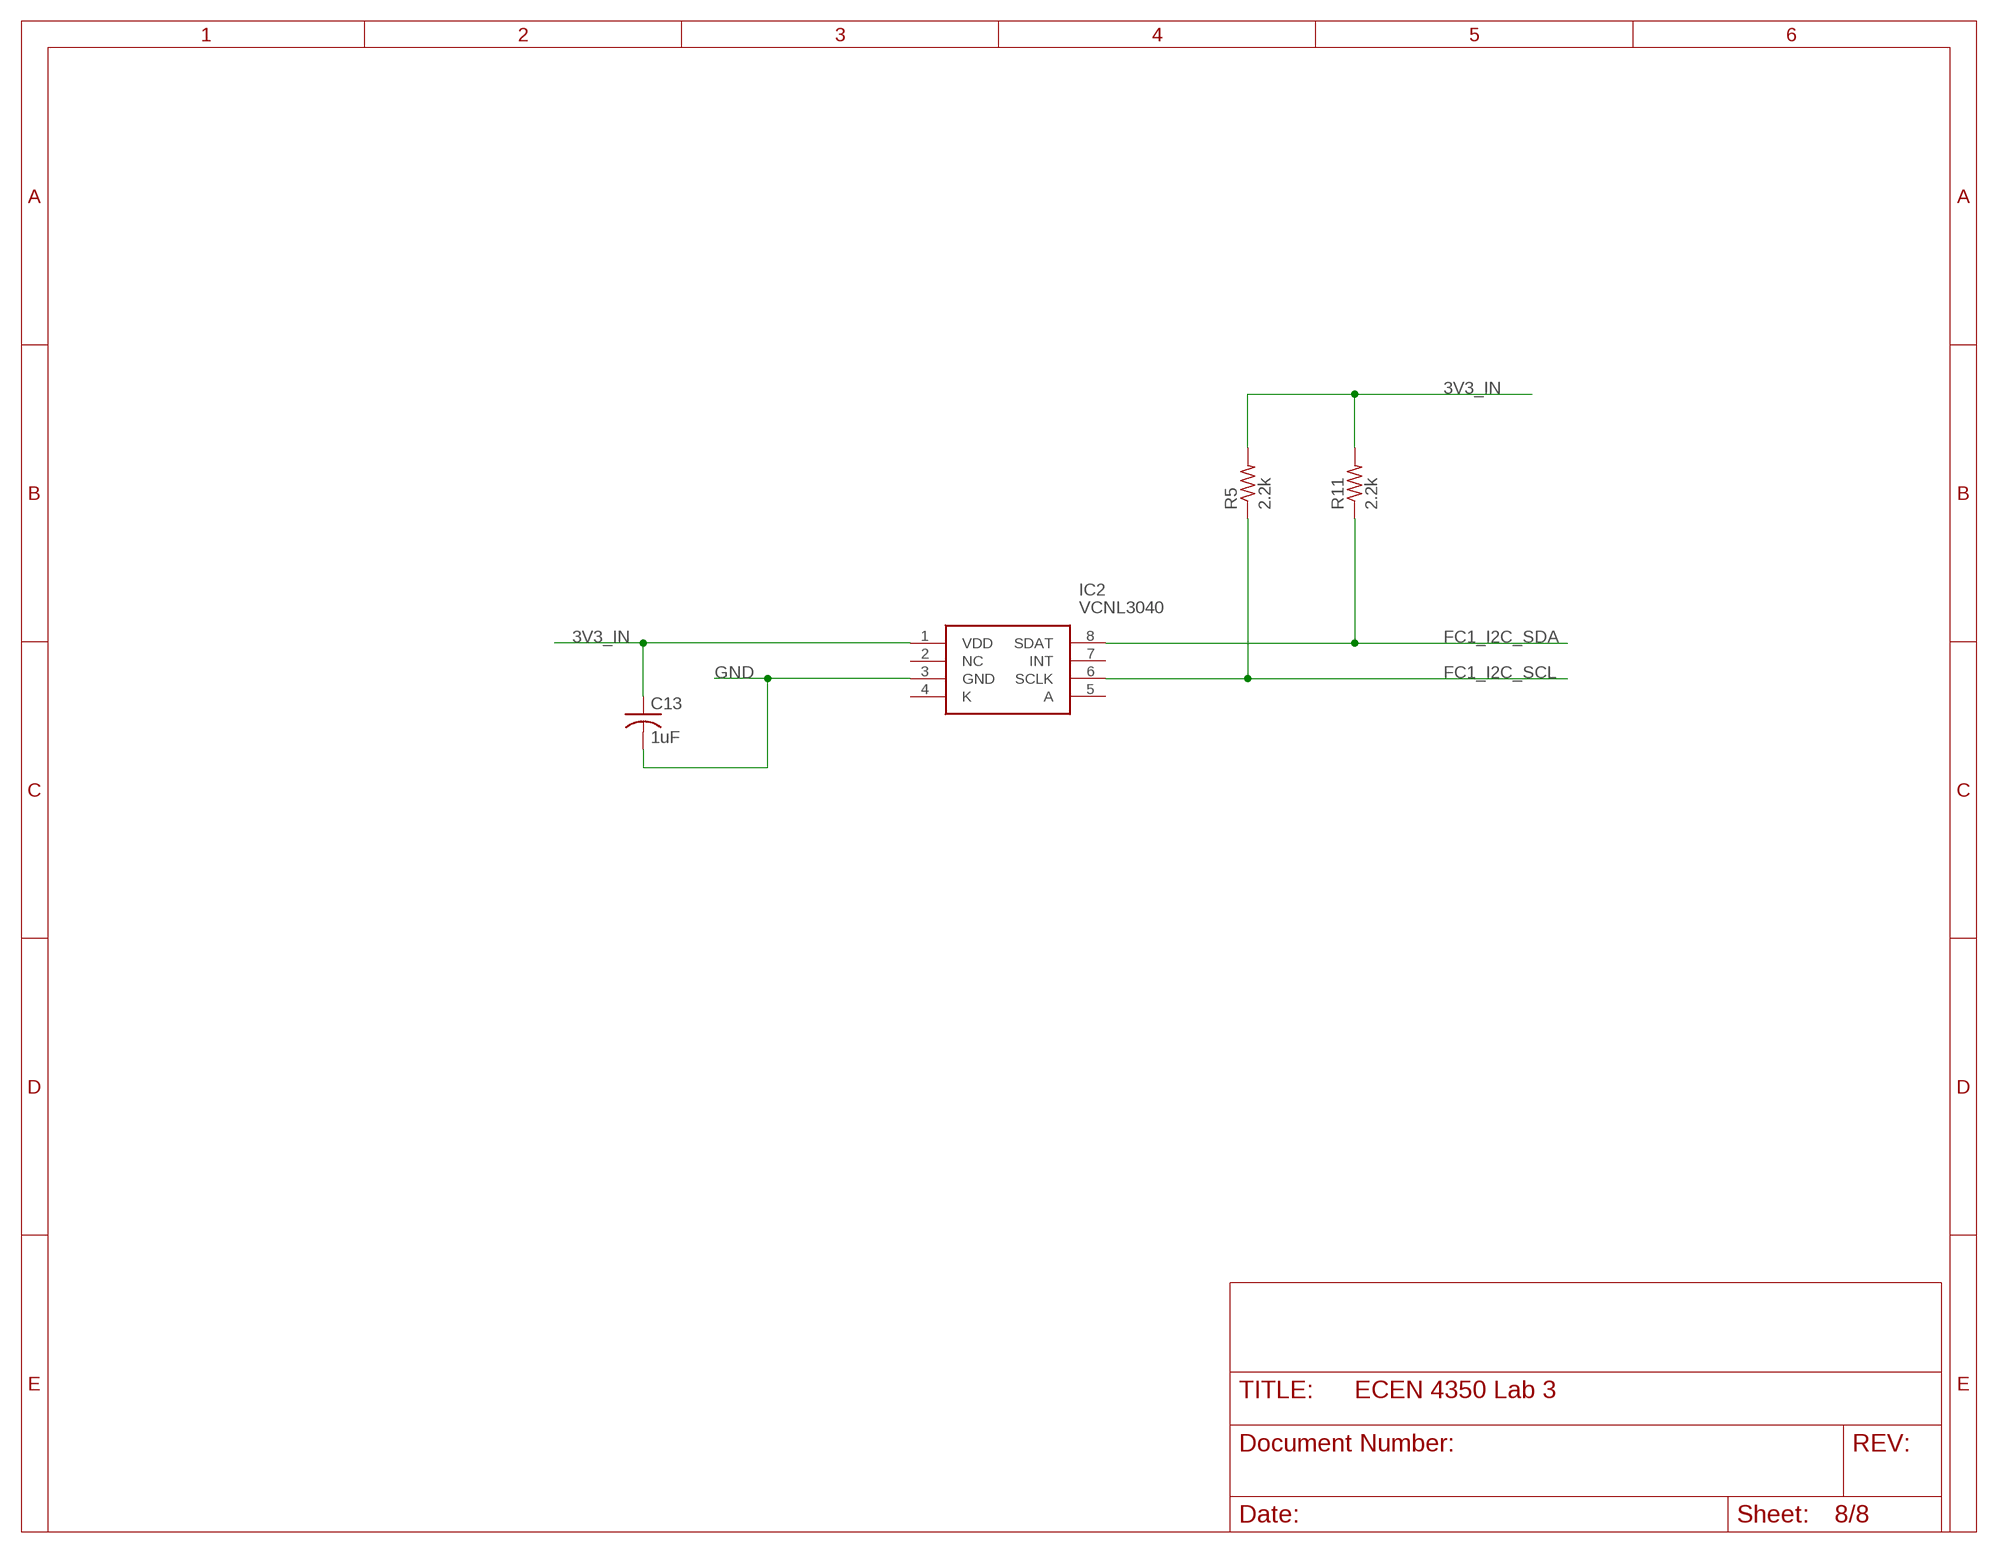
[diagram p7: schematic, sheet 8]

### Parts
C13  1uF  C-USC1206  [C1206]
IC2  VCNL3040  [SON108P200X400X115-8N]
R5  2.2k  R-US_M1206  [M1206]
R11  2.2k  R-US_M1206  [M1206]

### Nets
3V3_IN: C13.1 IC2.1(VDD) R5.2 R11.2 ; also sheet 1,3,4,5,6,7
FC1_I2C_SCL: IC2.6(SCLK) R5.1 ; also sheet 1,7
FC1_I2C_SDA: IC2.8(SDAT) R11.1 ; also sheet 1,7
GND: C13.2 IC2.3(GND) ; also sheet 1,2,3,4,5,6,7
Unconnected: IC2.2(NC) IC2.4(K) IC2.5(A) IC2.7(INT)

## Library data of the parts
C1-C13 = rcl:C-US: CAPACITOR, American symbol; SPICEPREFIX: C
IC1 = SamacSys_Parts:TPD2E2U06DCKR: ESD Suppressors / TVS Diodes Source: Datasheet <https://www.ti.com/lit/gpn/TPD2E2U06>; DESCRIPTION: ESD Suppressors / TVS Diodes; HEIGHT: 1.1mm; MANUFACTURER_NAME: Texas Instruments; MANUFACTURER_PART_NUMBER: TPD2E2U06DCKR; MOUSER_PART_NUMBER: 595-TPD2E2U06DCKR; MOUSER_PRICE-STOCK: https://www.mouser.co.uk/ProductDetail/Texas-Instruments/TPD2E2U06DCKR?qs=xZ%2FP%252Ba9zWqa9UMTS1HgCWA%3D%3D
IC2 = SamacSys_Parts:VCNL3040: VISHAY - VCNL3040 - Proximity Sensor, I2C, 300 mm, QFN, 8 Pins, 2.5 V, 3.6 V Source: Datasheet; DESCRIPTION: VISHAY - VCNL3040 - Proximity Sensor, I2C, 300 mm, QFN, 8 Pins, 2.5 V, 3.6 V; HEIGHT: 1.15mm; MANUFACTURER_NAME: Vishay; MANUFACTURER_PART_NUMBER: VCNL3040; MOUSER_PART_NUMBER: 78-VCNL3040; MOUSER_PRICE-STOCK: https://www.mouser.co.uk/ProductDetail/Vishay-Semiconductors/VCNL3040?qs=bZr6mbWTK5m90GodUNdcvA%3D%3D
J1 = USB2066-05-RBHM-XX-STB-00-00-A_REVD:USB2066-05-RBHM-XX-STB-00-00-A_REVD: Mimi USB Receptacle, Type B, 5 Pin, SMT, Horizontal, Optional Post, 9.40mm Length; DESCRIPTION: USB - mini B USB 2.0 Receptacle Connector 5 Position Surface Mount, Right Angle; DIGI-KEY_PART_NUMBER: 2073-USB2066-05-RBHM-15-STB-00-00-ACT-ND; MF: Global Connector Technology; MP: USB2066-05-RBHM-15-STB-00-00-A; PACKAGE: None; PURCHASE-URL: https://pricing.snapeda.com/search/part/USB2066-05-RBHM-15-STB-00-00-A/?ref=eda
J2 = SamacSys_Parts:RASM712BKZ: SWITCHCRAFT/CONXALL - RASM712BKZ - DC POWER JACK, BKZ LOCKING SERIES, 2.5MM SURFACE MOUNT 99AC7761 Source: Datasheet <https://www.mouser.de/datasheet/2/393/RASM712BKZ_CD-1545617.pdf>; DESCRIPTION: SWITCHCRAFT/CONXALL - RASM712BKZ - DC POWER JACK, BKZ LOCKING SERIES, 2.5MM SURFACE MOUNT 99AC7761; HEIGHT: 11mm; MANUFACTURER_NAME: Switchcraft; MANUFACTURER_PART_NUMBER: RASM712BKZ; MOUSER_PART_NUMBER: 502-RASM712BKZ; MOUSER_PRICE-STOCK: https://www.mouser.co.uk/ProductDetail/Switchcraft/RASM712BKZ?qs=vLWxofP3U2yBEWGo0srVpw%3D%3D
J3 = SamacSys_Parts:M50-3600542R: HARWIN Archer M50, 1.27mm Pitch, 10 Way, 2 Row Unshrouded, Right Angle Pin Header, Surface Mount, Solder Termination Source: Datasheet <https://cdn.harwin.com/pdfs/M50-360R.pdf>; DESCRIPTION: HARWIN Archer M50, 1.27mm Pitch, 10 Way, 2 Row Unshrouded, Right Angle Pin Header, Surface Mount, Solder Termination; HEIGHT: mm; MANUFACTURER_NAME: Harwin; MANUFACTURER_PART_NUMBER: M50-3600542R; MOUSER_PART_NUMBER: 855-M50-3600542R; MOUSER_PRICE-STOCK: https://www.mouser.co.uk/ProductDetail/Harwin/M50-3600542R?qs=DVxm2sPGGrrPu%2FxuhpV3yw%3D%3D
JP1-JP4 = pinhead:PINHD-1X16: PIN HEADER
JP5 = pinhead:PINHD-1X2: PIN HEADER
JP6 = pinhead:PINHD-1X8: PIN HEADER
L1 = SamacSys_Parts:CBC3225T4R7MR: CBC3225T4R7MR Source: Datasheet <https://ds.yuden.co.jp/TYCOMPAS/ut/detail?pn=CBC3225T4R7MR &u=M>; ARROW_PART_NUMBER: CBC3225T4R7MR; ARROW_PRICE-STOCK: https://www.arrow.com/en/products/cbc3225t4r7mr/taiyo-yuden; DESCRIPTION: CBC3225T4R7MR; HEIGHT: 2.7mm; MANUFACTURER_NAME: TAIYO YUDEN; MANUFACTURER_PART_NUMBER: CBC3225T4R7MR; MOUSER_PART_NUMBER: 963-CBC3225T4R7MR; MOUSER_PRICE-STOCK: https://www.mouser.co.uk/ProductDetail/Taiyo-Yuden/CBC3225T4R7MR?qs=I6KAKw0tg2xjmWcWwswk9Q%3D%3D
LED1 = SamacSys_Parts:BR1101W-TR: Standard LEDs - SMD Surface Mount LED Source: Datasheet <https://media.digikey.com/pdf/Data Sheets/Stanley Electric PDFs/1101W_Series.pdf>; DESCRIPTION: Standard LEDs - SMD Surface Mount LED; HEIGHT: 1.9mm; MANUFACTURER_NAME: Stanley Electric; MANUFACTURER_PART_NUMBER: BR1101W-TR; MOUSER_PART_NUMBER: 327-BR1101WTR; MOUSER_PRICE-STOCK: https://www.mouser.co.uk/ProductDetail/Stanley-Electric/BR1101W-TR?qs=byeeYqUIh0Pp62ktTXSSvA%3D%3D
PS1 = SamacSys_Parts:MIC5317-3.3YM5-TR: LDO Voltage Regulators Single LDO, Hi-Perf. 150mA, 3.3 Vout Source: Datasheet; DESCRIPTION: LDO Voltage Regulators Single LDO, Hi-Perf. 150mA, 3.3 Vout; HEIGHT: 1mm; MANUFACTURER_NAME: Microchip; MANUFACTURER_PART_NUMBER: MIC5317-3.3YM5-TR; MOUSER_PART_NUMBER: 998-MIC5317-3.3YM5TR; MOUSER_PRICE-STOCK: https://www.mouser.co.uk/ProductDetail/Microchip-Technology-Micrel/MIC5317-33YM5-TR?qs=U6T8BxXiZAUR0BSg3XdMLw%3D%3D
R1-R9 R11 = rcl:R-US_: RESISTOR, American symbol; SPICEPREFIX: R
S1 = SamacSys_Parts:452403012014: Slide Switches WS-SLSV Slide Switch SMD 7.65mm x 5.5mm Source: Datasheet <https://katalog.we-online.de/em/datasheet/452403012014.pdf>; DESCRIPTION: Slide Switches WS-SLSV Slide Switch SMD 7.65mm x 5.5mm; HEIGHT: 3.3mm; MANUFACTURER_NAME: Wurth Elektronik; MANUFACTURER_PART_NUMBER: 452403012014; MOUSER_PART_NUMBER: 710-452403012014; MOUSER_PRICE-STOCK: https://www.mouser.co.uk/ProductDetail/Wurth-Elektronik/452403012014?qs=DvsTirrhYfOi0QxHyAEO3w%3D%3D
S2-S5 = SamacSys_Parts:1301.9315: SCHURTER - 1301.9315 - SWITCH, SMD, PUSH, 5MM Source: Datasheet <https://ch.schurter.com/en/datasheet/typ_6x6_mm_tact_switches.pdf>; DESCRIPTION: SCHURTER - 1301.9315 - SWITCH, SMD, PUSH, 5MM; HEIGHT: 9mm; MANUFACTURER_NAME: SCHURTER; MANUFACTURER_PART_NUMBER: 1301.9315; MOUSER_PART_NUMBER: 693-1301.9315; MOUSER_PRICE-STOCK: https://www.mouser.co.uk/ProductDetail/Schurter/13019315?qs=tGaZrb6HVSaeSttQbZxh%2FA%3D%3D
U1 = LPC55S14JBD64E:LPC55S14JBD64E; COPYRIGHT: Copyright (C) 2021 Ultra Librarian. All rights reserved.; MANUFACTURER_PART_NUMBER: LPC55S14JBD64E; MFR_NAME: NXP
U2 = SN65HVD231QDR:SN65HVD231QDR: Check prices <https://pricing.snapeda.com/parts/SN65HVD231QDR/Texas%20Instruments/view-part?ref=eda>; AVAILABILITY: In Stock; DESCRIPTION: 3.3-V CAN Transceiver with Sleep Mode 8-SOIC -40 to 125; MF: Texas Instruments; MP: SN65HVD231QDR; PACKAGE: SOIC-8 Texas Instruments; PRICE: None; PURCHASE-URL: https://pricing.snapeda.com/search/part/SN65HVD231QDR/?ref=eda
U3 = 48LM01-I_SM:48LM01-I/SM; COPYRIGHT: Copyright (C) 2021 Ultra Librarian. All rights reserved.; DIGI-KEY_PART_NUMBER_1: 150-48LM01-I/SM-ND; MANUFACTURER_PART_NUMBER: 48LM01-I/SM; MFR_NAME: Microchip
U4 = ESP-WROOM-02:ESP-WROOM-02: Wi-Fi Module w/ESP8266 802.11b/g/n 20dBm 20x18x3mm; DESCRIPTION: WiFi 802.11b/g/n Transceiver Module 2.4GHz ~ 2.5GHz Integrated, Trace Surface Mount; DIGI-KEY_PART_NUMBER: 1904-1009-1-ND; MF: Espressif Systems; MP: ESP-WROOM-02; PACKAGE: SMD-18 Espressif Systems; PURCHASE-URL: https://pricing.snapeda.com/search/part/ESP-WROOM-02/?ref=eda
X1 = con-jst:?4B-ZR: ZH CONNECTOR 1.5 mm, 4 pin 1 row Source: http://www.jst.com .. eZH.pdf; MF: FARNELL; MPN: S4B-ZR(LF)(SN); OC_FARNELL: 9491830; OC_NEWARK: 38K8076

## Board
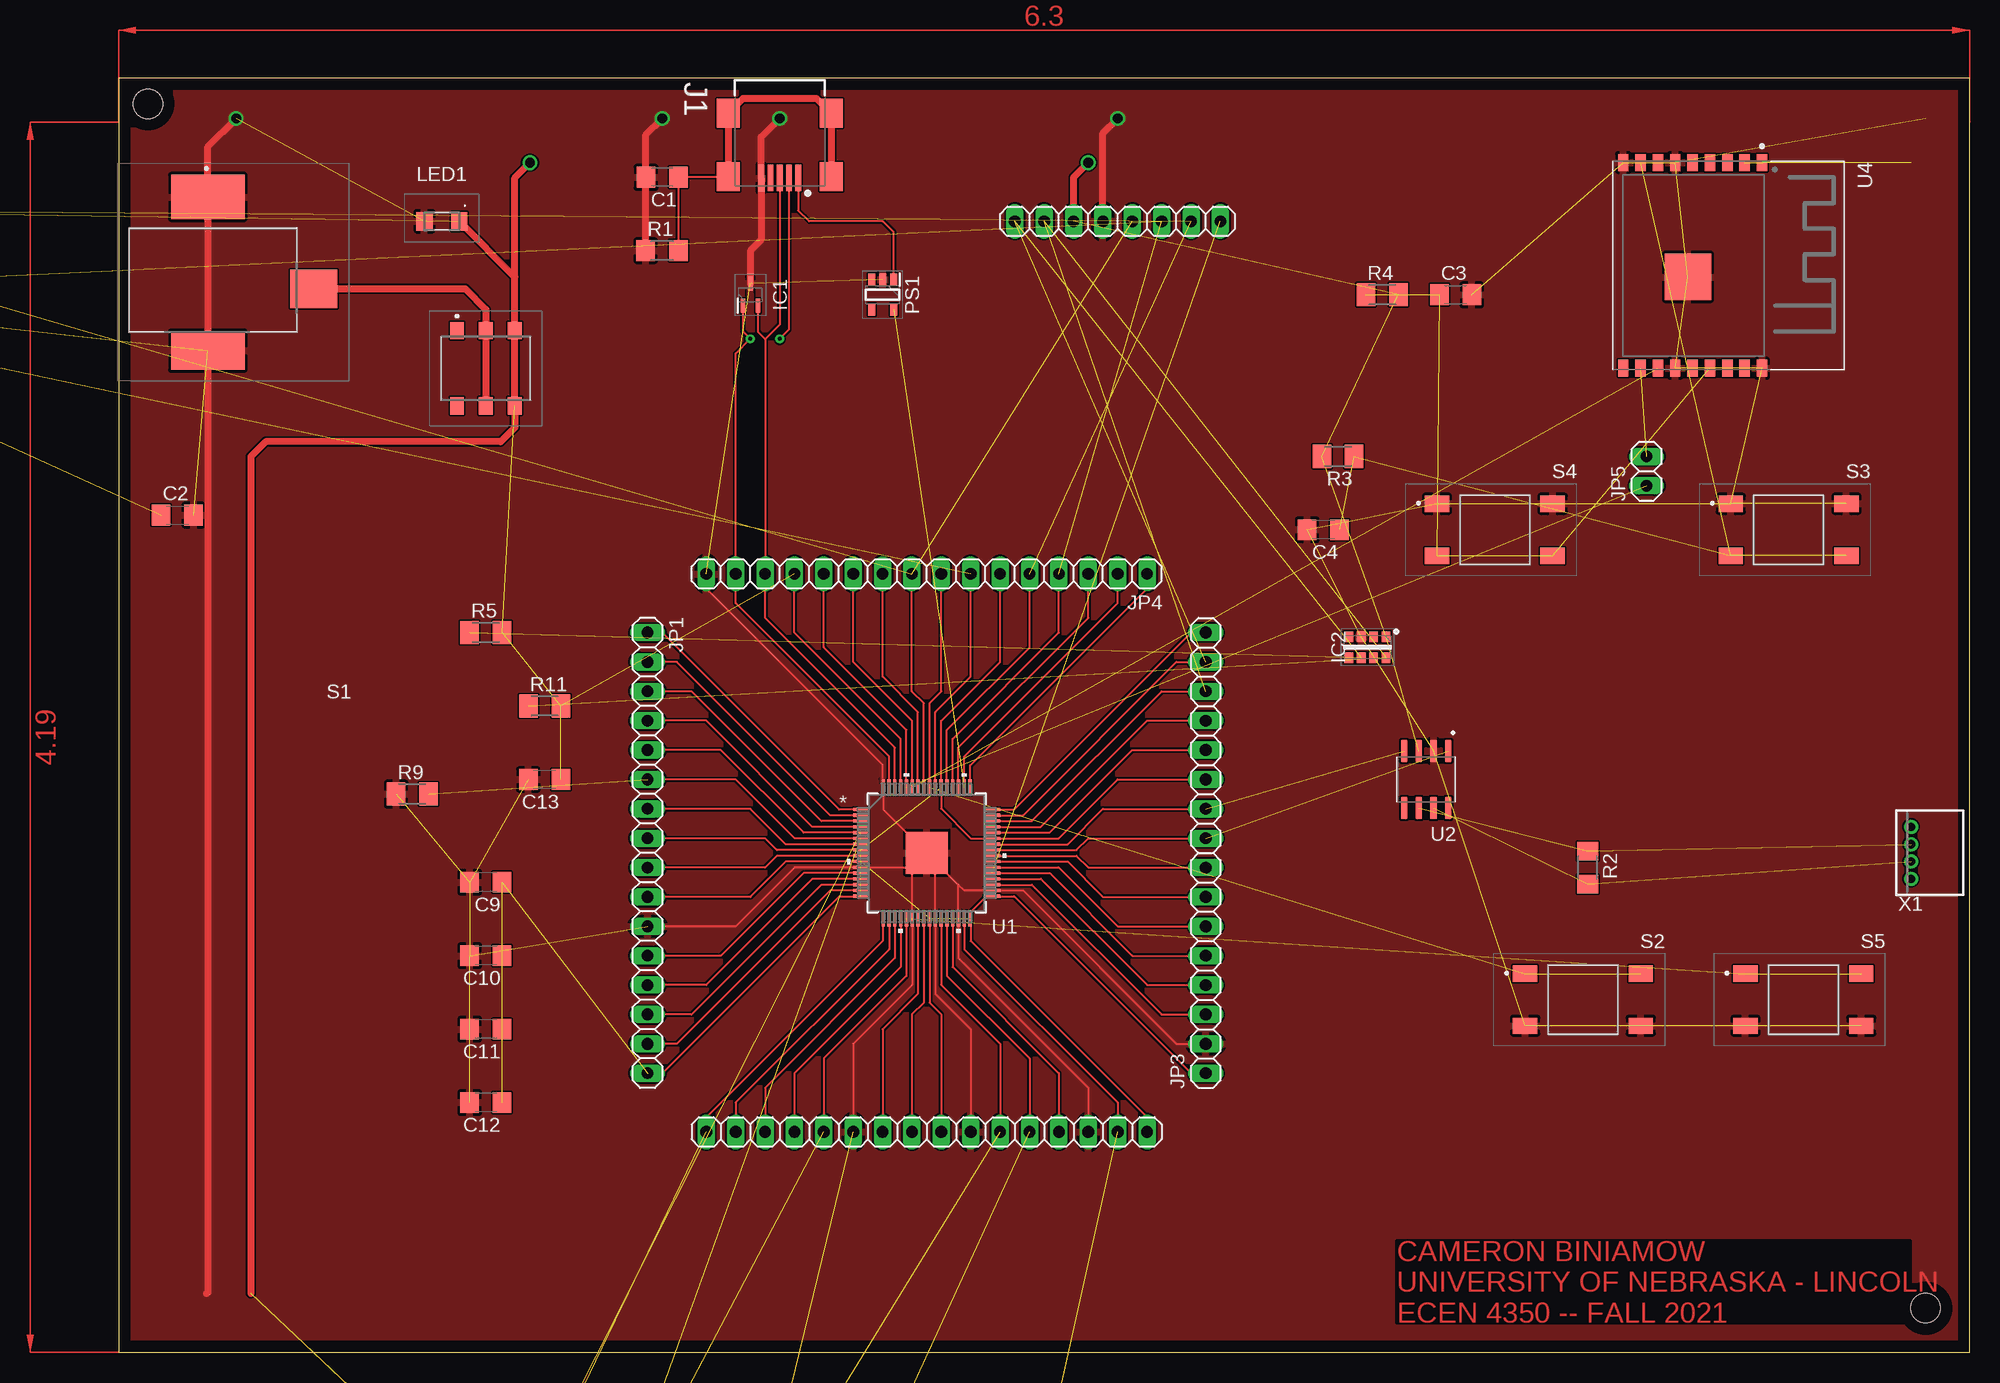
[diagram p8: board, top side]
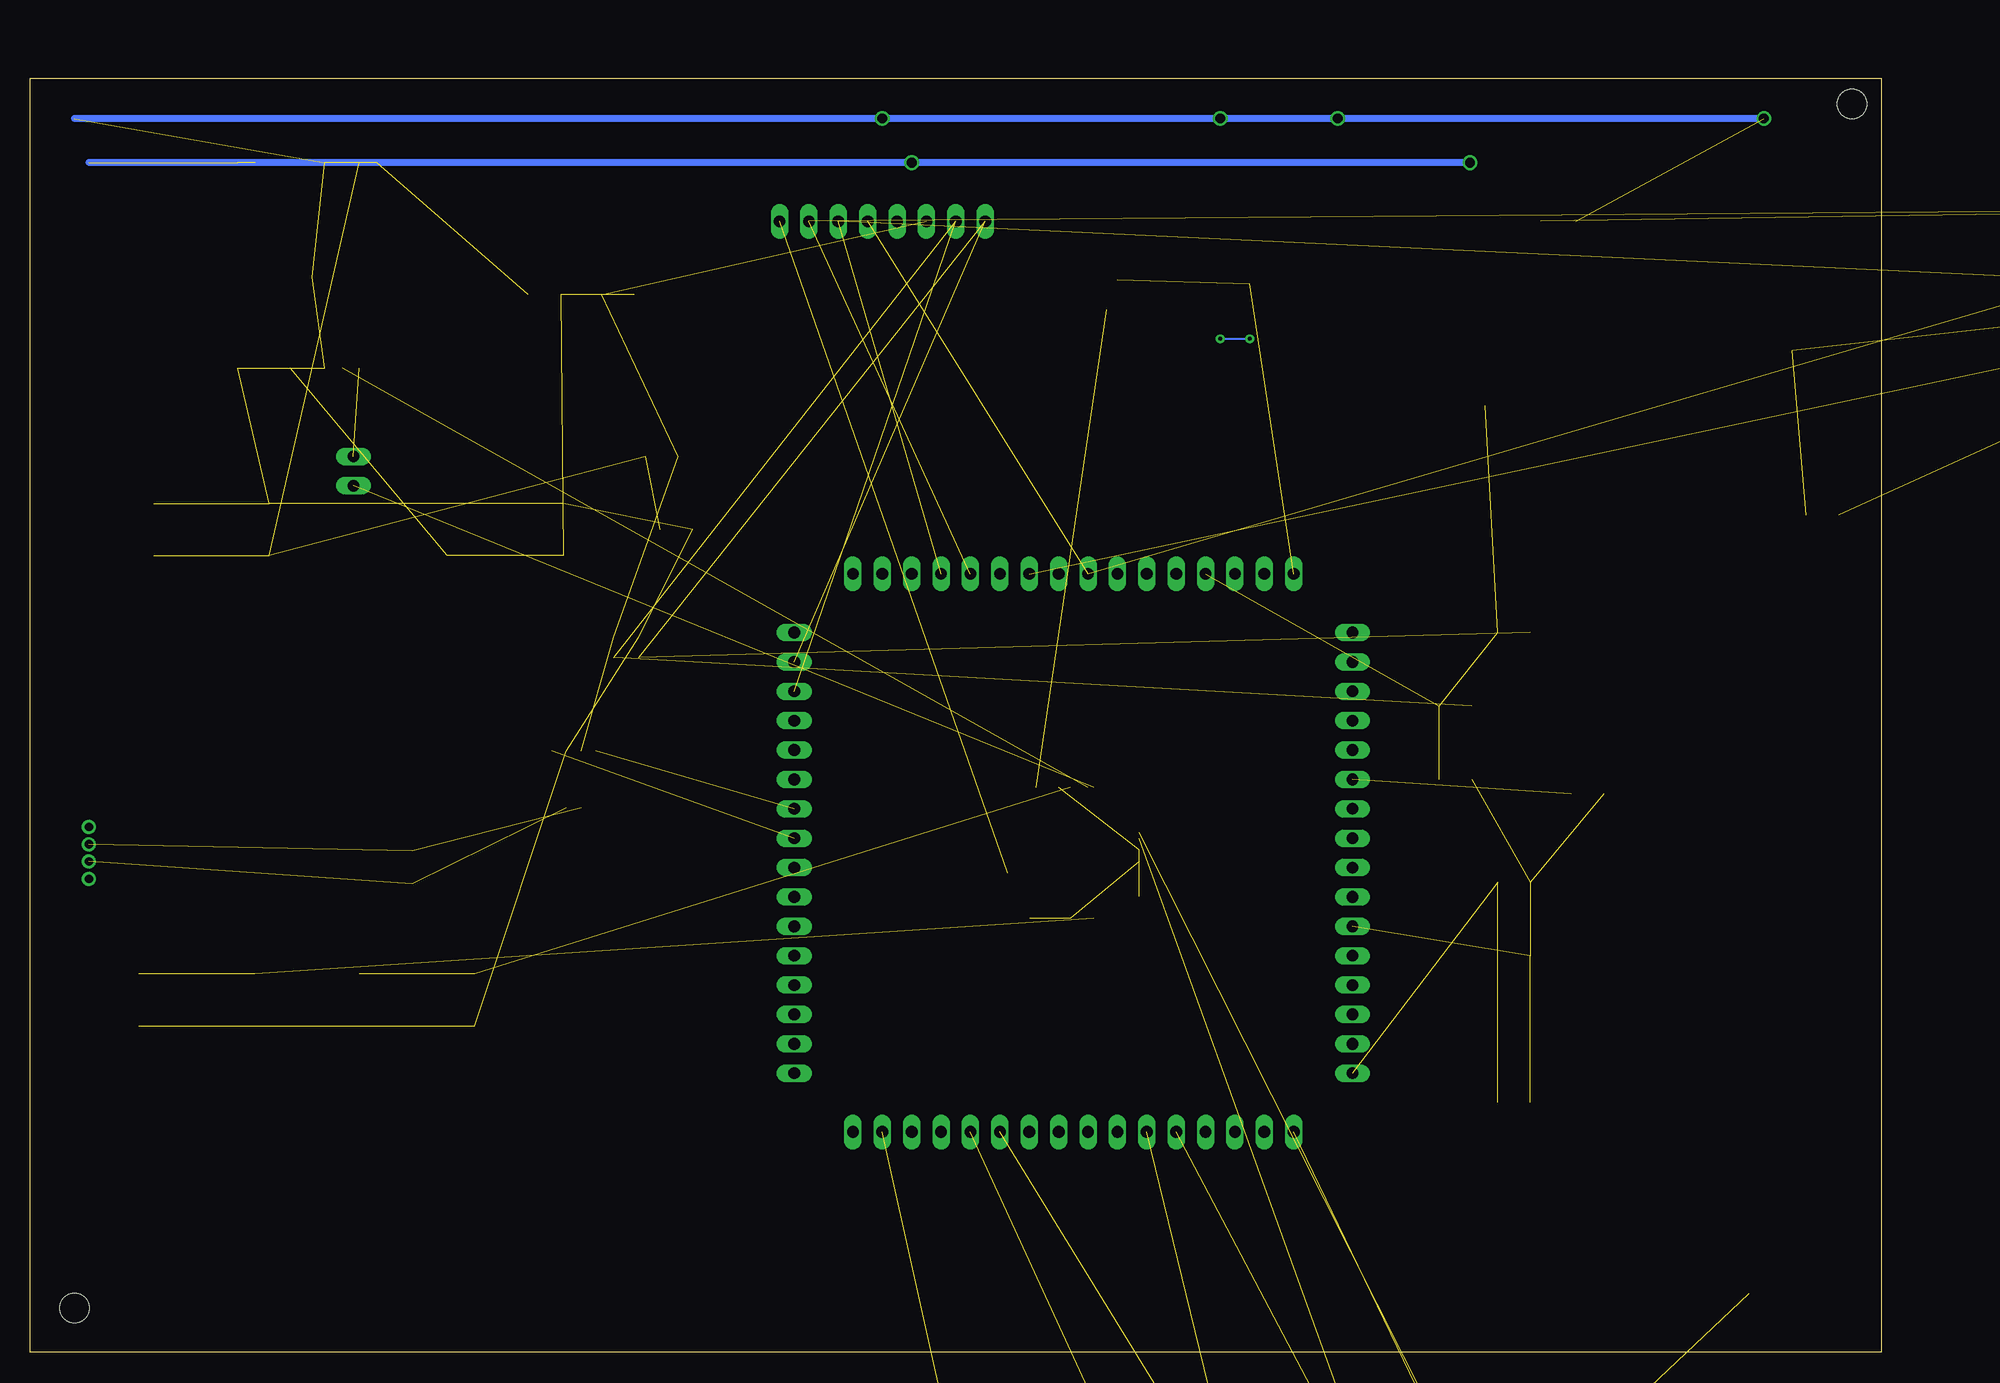
[diagram p9: board, bottom side, seen from below]

Size 160 x 110.16 mm. Coordinates in mm from the lower left corner, seen from the top.
Outline: 0,0 160,0 160,110.16 0,110.16 0,0
Copper layers (1*16): Top 0.035mm / dielectric 1.5mm / Bottom 0.035mm
Design rules "default": minimum track width 6mil, minimum drill 0.35mm, track to track 6mil, track to pad 6mil, pad to pad 6mil, via to via 6mil, smd to smd 6mil, copper to edge 40mil, drill to drill 6mil, minimum pad ring 10mil, minimum via ring 8mil, stop-mask expansion 4mil, vias tented up to drill 0mil, thermal gap 10mil
Holes 2.54 mm at 2.54,107.95 156.21,3.81

### Footprints (pad centres in the part's own frame; a part is rotated, then mirrored left to right if it is on the bottom)
C1206 = smd 1.6 x 1.8: 1 -1.4,0; 2 1.4,0
SOT65P210X110-3N = smd 1.2 x 0.4: 1 -0.95,0.65; 2 -0.95,-0.65; 3 0.95,0
SON108P200X400X115-8N = smd 0.9 x 0.75: 1 -0.9,1.612; 2 -0.9,0.538; 3 -0.9,-0.538; 4 -0.9,-1.612; 5 0.9,-1.612; 6 0.9,-0.538; 7 0.9,0.538; 8 0.9,1.612
GCT_USB2066-05-RBHM-XX-STB-00-00-A_REVD = smd 0.5 x 2.3: 1 -1.6,2.6; 2 -0.8,2.6; 3 0,2.6; 4 0.8,2.6; 5 1.6,2.6 | smd 2 x 2.5: 6 4.45,-3; 7 4.45,2.5; 8 -4.45,-3; 9 -4.45,2.5
RASM712BKZ = smd 3.81 x 6.35: 1 -7.19,-1.17 | smd 3.3 x 6.35: 2 6.1,-1.17 | smd 3.3 x 4.06: 3 0.76,7.97
HUSSP10W40P127_2X5_635X340X420 = smd 0.65 x 2.85: 1 -2.54,-1.675; 2 -2.54,1.675; 3 -1.27,-1.675; 4 -1.27,1.675; 5 0,-1.675; 6 0,1.675; 7 1.27,-1.675; 8 1.27,1.675; 9 2.54,-1.675; 10 2.54,1.675
1X16 = drill 1.016 long: 1 -19.05,0; 2 -16.51,0; 3 -13.97,0; 4 -11.43,0; 5 -8.89,0; 6 -6.35,0; 7 -3.81,0; 8 -1.27,0; 9 1.27,0; 10 3.81,0; 11 6.35,0; 12 8.89,0; 13 11.43,0; 14 13.97,0; 15 16.51,0; 16 19.05,0
1X02 = drill 1.016 long: 1 -1.27,0; 2 1.27,0
1X08 = drill 1.016 long: 1 -8.89,0; 2 -6.35,0; 3 -3.81,0; 4 -1.27,0; 5 1.27,0; 6 3.81,0; 7 6.35,0; 8 8.89,0
INDC3225X270N = smd 1.3 x 2.7: 1 -1.4,0; 2 1.4,0
BR1101WTR = smd 1.6 x 1.4: 1 0,1.5; 2 0,-1.5
SOT95P280X100-5N = smd 1.05 x 0.6: 1 -1.3,0.95; 2 -1.3,0; 3 -1.3,-0.95; 4 1.3,-0.95; 5 1.3,0.95
R1206 = smd 1.6 x 1.803: 1 -1.422,0; 2 1.422,0
M1206 = smd 1.6 x 2: 1 -1.4,0; 2 1.4,0
452403012014 = smd 1.2 x 1.5: 1 -2.5,3.25; 2 0,3.25; 3 2.5,3.25; 4 -2.5,-3.25; 5 0,-3.25; 6 2.5,-3.25
13019319 = smd 2.1 x 1.4: 1 -4.15,2.25; 2 5.85,2.25; 3 -4.15,-2.25; 4 5.85,-2.25
HTQFP64_10X10_NXP = smd 1.346 x 0.279: 1 -5.677,3.75; 2 -5.677,3.25; 3 -5.677,2.75; 4 -5.677,2.25; 5 -5.677,1.75; 6 -5.677,1.25; 7 -5.677,0.75; 8 -5.677,0.25; 9 -5.677,-0.25; 10 -5.677,-0.75; 11 -5.677,-1.25; 12 -5.677,-1.75; 13 -5.677,-2.25; 14 -5.677,-2.75; 15 -5.677,-3.25; 16 -5.677,-3.75; 33 5.677,-3.75; 34 5.677,-3.25; 35 5.677,-2.75; 36 5.677,-2.25; 37 5.677,-1.75; 38 5.677,-1.25; 39 5.677,-0.75; 40 5.677,-0.25; 41 5.677,0.25; 42 5.677,0.75; 43 5.677,1.25; 44 5.677,1.75; 45 5.677,2.25; 46 5.677,2.75; 47 5.677,3.25; 48 5.677,3.75 | smd 0.279 x 1.346: 17 -3.75,-5.677; 18 -3.25,-5.677; 19 -2.75,-5.677; 20 -2.25,-5.677; 21 -1.75,-5.677; 22 -1.25,-5.677; 23 -0.75,-5.677; 24 -0.25,-5.677; 25 0.25,-5.677; 26 0.75,-5.677; 27 1.25,-5.677; 28 1.75,-5.677; 29 2.25,-5.677; 30 2.75,-5.677; 31 3.25,-5.677; 32 3.75,-5.677; 49 3.75,5.677; 50 3.25,5.677; 51 2.75,5.677; 52 2.25,5.677; 53 1.75,5.677; 54 1.25,5.677; 55 0.75,5.677; 56 0.25,5.677; 57 -0.25,5.677; 58 -0.75,5.677; 59 -1.25,5.677; 60 -1.75,5.677; 61 -2.25,5.677; 62 -2.75,5.677; 63 -3.25,5.677; 64 -3.75,5.677 | smd 3.607 x 3.607: EPAD 0,0
SOIC127P599X175-8N = smd 1.97 x 0.6: 1 -2.47,1.905; 2 -2.47,0.635; 3 -2.47,-0.635; 4 -2.47,-1.905; 5 2.47,-1.905; 6 2.47,-0.635; 7 2.47,0.635; 8 2.47,1.905
SOIJ8_SM_MCH = smd 1.473 x 0.559: 1 -3.594,1.905; 2 -3.594,0.635; 3 -3.594,-0.635; 4 -3.594,-1.905; 5 3.594,-1.905; 6 3.594,-0.635; 7 3.594,0.635; 8 3.594,1.905
MODULE_ESP-WROOM-02 = smd 1.485 x 0.9: 1 -8.893,4.9; 2 -8.893,3.4; 3 -8.893,1.9; 4 -8.893,0.4; 5 -8.893,-1.1; 6 -8.893,-2.6; 7 -8.893,-4.1; 8 -8.893,-5.6; 9 -8.893,-7.1; 10 8.893,-7.1; 11 8.893,-5.6; 12 8.893,-4.1; 13 8.893,-2.6; 14 8.893,-1.1; 15 8.893,0.4; 16 8.893,1.9; 17 8.893,3.4; 18 8.893,4.9 | smd 4 x 4: 19 1,-1.5
S4B-ZR = drill 0.7 pad 1.1: 1 -2.25,0; 2 -0.75,0; 3 0.75,0; 4 2.25,0

### Placement (x,y rotation side)
C1  46.99,101.6 180 top
C2  5.08,72.39 0 top
C3  115.57,91.44 0 top
C4  104.14,71.12 180 top
C5  58.42,-20.32 180 top  (outside the outline)
C6  58.42,-13.97 180 top  (outside the outline)
C7  58.42,-7.62 180 top  (outside the outline)
C8  67.31,-8.89 0 top  (outside the outline)
C9  31.75,40.64 180 top
C10  31.75,34.29 180 top
C11  31.75,27.94 180 top
C12  31.75,21.59 180 top
C13  36.83,49.53 180 top
IC1  54.61,91.44 90 top
IC2  107.95,60.96 270 top
J1  57.15,104.14 180 top
J2  8.89,92.71 270 top
J3  43.18,-19.05 0 top  (outside the outline)
JP1  45.72,43.18 270 top
JP2  69.85,19.05 0 top
JP3  93.98,43.18 90 top
JP4  69.85,67.31 180 top
JP5  132.08,76.2 90 top
JP6  86.36,97.79 180 top
L1  78.74,-8.89 0 top  (outside the outline)
LED1  27.94,97.79 270 top
PS1  66.04,91.44 270 top
R1  46.99,95.25 0 top
R2  127,41.91 270 top
R3  105.41,77.47 180 top
R4  109.22,91.44 0 top
R5  31.75,62.23 0 top
R6  33.02,-13.97 180 top  (outside the outline)
R7  39.37,-7.62 0 top  (outside the outline)
R8  48.26,-7.62 0 top  (outside the outline)
R9  25.4,48.26 0 top
R11  36.83,55.88 0 top
S1  31.75,85.09 0 top
S2  125.73,30.48 0 top
S3  143.51,71.12 0 top
S4  118.11,71.12 0 top
S5  144.78,30.48 0 top
U1  69.85,43.18 0 top
U2  113.03,49.53 270 top
U3  -39.37,95.25 90 top  (outside the outline)
U4  137.16,93.98 270 top
X1  154.94,43.18 90 top

### Tracks (layer width: path | path; a pad name or v marks a point on that pad's centre or on a via)
1
  Top 0.152: U1.1 62.29,46.93 46.99,62.23 JP1.1
2
  Top 0.152: U1.2 61.52,46.43 48.26,59.69 JP1.2
3
  Top 0.152: U1.3 60.75,45.93 49.53,57.15 JP1.3
3V3_IN  (via drill 0.85)  (16 unrouted)
  Top 0.152: U1.61 67.6,53.05 58.42,62.23 JP4.13
  Top 0.61: 34.25,92.98 S1.3 S1.6 34.25,79.97 33.02,78.74 12.7,78.74 11.43,77.47 11.43,5.08 | 34.25,92.98 LED1.1 | 34.25,92.98 34.25,101.56 v35.56,102.87 | JP6.6 82.55,101.6 v83.82,102.87
  Bottom 0.61: v35.56,102.87 v83.82,102.87 154.94,102.87
7
  Top 0.152: U1.7 57.67,43.93 54.61,46.99 JP1.7
12
  Top 0.152: U1.12 59.21,41.43 52.07,34.29 JP1.12
13
  Top 0.152: U1.13 59.98,40.93 50.8,31.75 JP1.13
14
  Top 0.152: U1.14 60.75,40.43 49.53,29.21 JP1.14
18
  Top 0.152: U1.18 66.6,34.85 53.34,21.59 JP2.2
19
  Top 0.152: U1.19 67.1,34.08 55.88,22.86 JP2.3
20
  Top 0.152: U1.20 67.6,33.31 58.42,24.13 JP2.4
23
  Top 0.152: U1.23 69.1,31 66.04,27.94 JP2.7
24
  Top 0.152: U1.24 69.6,30.23 68.58,29.21 JP2.8
35
  Top 0.152: U1.35 78.95,40.43 90.17,29.21 JP3.3
36
  Top 0.152: U1.36 79.72,40.93 88.9,31.75 JP3.4
38
  Top 0.152: U1.38 81.26,41.93 86.36,36.83 JP3.6
39
  Top 0.152: U1.39 82.03,42.43 85.09,39.37 JP3.7
40
  Top 0.152: U1.40 82.8,42.93 83.82,41.91 JP3.8
44
  Top 0.152: U1.44 80.49,44.93 87.63,52.07 JP3.12
45
  Top 0.152: U1.45 79.72,45.43 88.9,54.61 JP3.13
48
  Top 0.152: U1.48 77.41,46.93 92.71,62.23 JP3.16
49
  Top 0.152: U1.49 73.6,50.74 88.9,66.04 JP4.1
51
  Top 0.152: U1.51 72.6,52.28 83.82,63.5 JP4.3
58
  Top 0.152: U1.58 69.1,55.36 66.04,58.42 JP4.10
+5V
  Top 0.152: J1.1 58.75,98.73 59.69,97.79 66.04,97.79 66.99,96.84 PS1.1
CAN0_RD  (1 unrouted)
  Top 0.152: U1.42 82.03,43.93 85.09,46.99 JP3.10
CAN0_TD  (1 unrouted)
  Top 0.152: U1.41 82.8,43.43 83.82,44.45 JP3.9
CAN_HIGH_BUS  (2 unrouted)
CAN_LOW_BUS  (2 unrouted)
FB  (3 unrouted)
  Top 0.152: U1.29 72.1,33.31 81.28,24.13 JP2.13 | U1.28 71.6,32.54 78.74,25.4 JP2.12
FC0_UART_CTS
  Top 0.152: U1.15 61.52,39.93 48.26,26.67 JP1.15
FC0_UART_RTS
  Top 0.152: U1.4 59.98,45.43 50.8,54.61 JP1.4
FC0_UART_RXD  (1 unrouted)
  Top 0.152: U1.59 68.6,54.59 63.5,59.69 JP4.11
FC0_UART_TXD  (1 unrouted)
  Top 0.152: U1.60 68.1,53.82 60.96,60.96 JP4.12
FC1_I2C_SCL  (3 unrouted)
  Top 0.152: U1.47 78.18,46.43 91.44,59.69 JP3.15
FC1_I2C_SDA  (3 unrouted)
  Top 0.152: U1.46 78.95,45.93 90.17,57.15 JP3.14
FC3_SPI_MISO  (2 unrouted)
  Top 0.152: U1.52 72.1,53.05 81.28,62.23 JP4.4
FC3_SPI_MOSI  (2 unrouted)
  Top 0.152: U1.53 71.6,53.82 78.74,60.96 JP4.5
FC3_SPI_SCK  (2 unrouted)
  Top 0.152: U1.57 69.6,56.13 68.58,57.15 JP4.9
FC3_SPI_SSEL0  (1 unrouted)
  Top 0.152: U1.55 70.6,55.36 73.66,58.42 JP4.7
FC3_SPI_SSEL2  (1 unrouted)
  Top 0.152: U1.37 80.49,41.43 87.63,34.29 JP3.5
GND  (via drill 0.85)  (34 unrouted)
  Top 0.152: JP2.14 83.82,22.86 72.6,34.08 U1.30 72.6,40.43 | JP2.10 73.66,27.94 70.6,31 U1.26 70.6,42.43 U1.EPAD | JP2.6 63.5,26.67 68.6,31.77 U1.22 68.6,41.93 | JP1.11 53.34,36.83 58.44,41.93 U1.11 68.6,41.93 | JP3.2 91.44,26.67 78.18,39.93 U1.34 73.1,39.93 72.6,40.43 | JP4.16 50.8,66.04 66.04,50.8 66.04,48.92 U1.64 66.1,46.93 U1.EPAD | 72.6,40.43 U1.EPAD | 68.6,41.93 U1.EPAD
  Top 0.61: v10.16,106.68 7.72,104.24 J2.1 J2.2 7.72,5.18 7.62,5.08 | R1.1 45.59,95.27 C1.2 45.59,105.28 v46.99,106.68 | IC1.3 54.61,95.25 55.55,96.19 J1.5 55.55,105.08 v57.15,106.68 | JP6.5 85.09,105.41 v86.36,106.68
  Bottom 0.61: v10.16,106.68 v46.99,106.68 v57.15,106.68 v86.36,106.68 156.21,106.68
  pour Top: 0,110.49 160.02,110.49 160.02,0 0,0
ISP0  (2 unrouted)
  Top 0.152: U1.56 70.1,56.13 71.12,57.15 JP4.8
LX  (1 unrouted)
  Top 0.152: U1.31 73.1,34.85 86.36,21.59 JP2.15
MCU_VDD  (6 unrouted)
  Top 0.152: U1.16 64.11,39.37 62.23,39.37 46.99,24.13 JP1.16 | U1.8 56.9,43.43 55.88,44.45 JP1.8 | JP3.11 86.36,49.53 81.26,44.43 U1.43 75.51,44.45 73.66,44.45 71.1,47.01 U1.54 71.1,54.59 76.2,59.69 JP4.6
N$1  (1 unrouted)
N$3  (1 unrouted)
N$7
  Top 0.152: R1.2 48.39,95.27 C1.1 48.43,101.64 J1.7
  Top 0.61: J1.7 J1.6 53.97,108.41 60.33,108.41 J1.8 J1.9
N$8  (4 unrouted)
N$11  (4 unrouted)
PWR_SRC
  Top 0.61: J2.3 29.97,91.95 31.75,90.17 S1.2 S1.5
RESETN  (4 unrouted)
  Top 0.152: U1.21 68.1,32.54 60.96,25.4 JP2.5
SWD_SWCLK  (2 unrouted)
  Top 0.152: U1.6 58.44,44.43 53.34,49.53 JP1.6
SWD_SWDIO  (2 unrouted)
  Top 0.152: U1.5 59.21,44.93 52.07,52.07 JP1.5
SWD_SWO  (2 unrouted)
  Top 0.152: U1.17 66.04,37.44 66.04,35.56 50.8,20.32 JP2.1
USB0_D+
  Top 0.152: U1.62 67.1,52.28 55.88,63.5 JP4.14 55.88,87.57 55.91,87.6 | J1.3 57.15,88.84 55.91,87.6 | IC1.2 55.26,88.25 55.91,87.6
USB0_D-  (via drill 0.35)
  Top 0.152: U1.63 66.6,51.51 53.34,64.77 JP4.15 53.34,86.36 v54.61,87.63 53.96,88.28 IC1.1 | J1.2 57.95,88.43 v57.15,87.63
  Bottom 0.152: v57.15,87.63 v54.61,87.63
USB0_VBUS  (1 unrouted)
  Top 0.152: U1.50 73.1,51.51 86.36,64.77 JP4.2
VBAT_DCDC  (6 unrouted)
  Top 0.152: JP2.16 88.9,20.32 73.66,35.56 73.66,37.44 U1.32 73.6,38.04 74.99,39.43 U1.33 77.41,39.43 92.71,24.13 JP3.1 | U1.27 71.1,31.77 76.2,26.67 JP2.11 | U1.25 70.1,30.23 71.12,29.21 JP2.9 | JP1.10 54.61,39.37 57.67,42.43 U1.10 U1.9 56.9,42.93 55.88,41.91 JP1.9
(copper drawn outside any net)
  shapes: Top area x2

### Text on the board
Top: CAMERON BINIAMOW / UNIVERSITY OF NEBRASKA - LINCOLN / ECEN 4350 -- FALL 2021